# EAGLE design permamote (EAGLE 8.4.2)
AUTHOR: NEAL JACKSON; REV: A; TITLE: MOTE

## Sheet 1 of 4
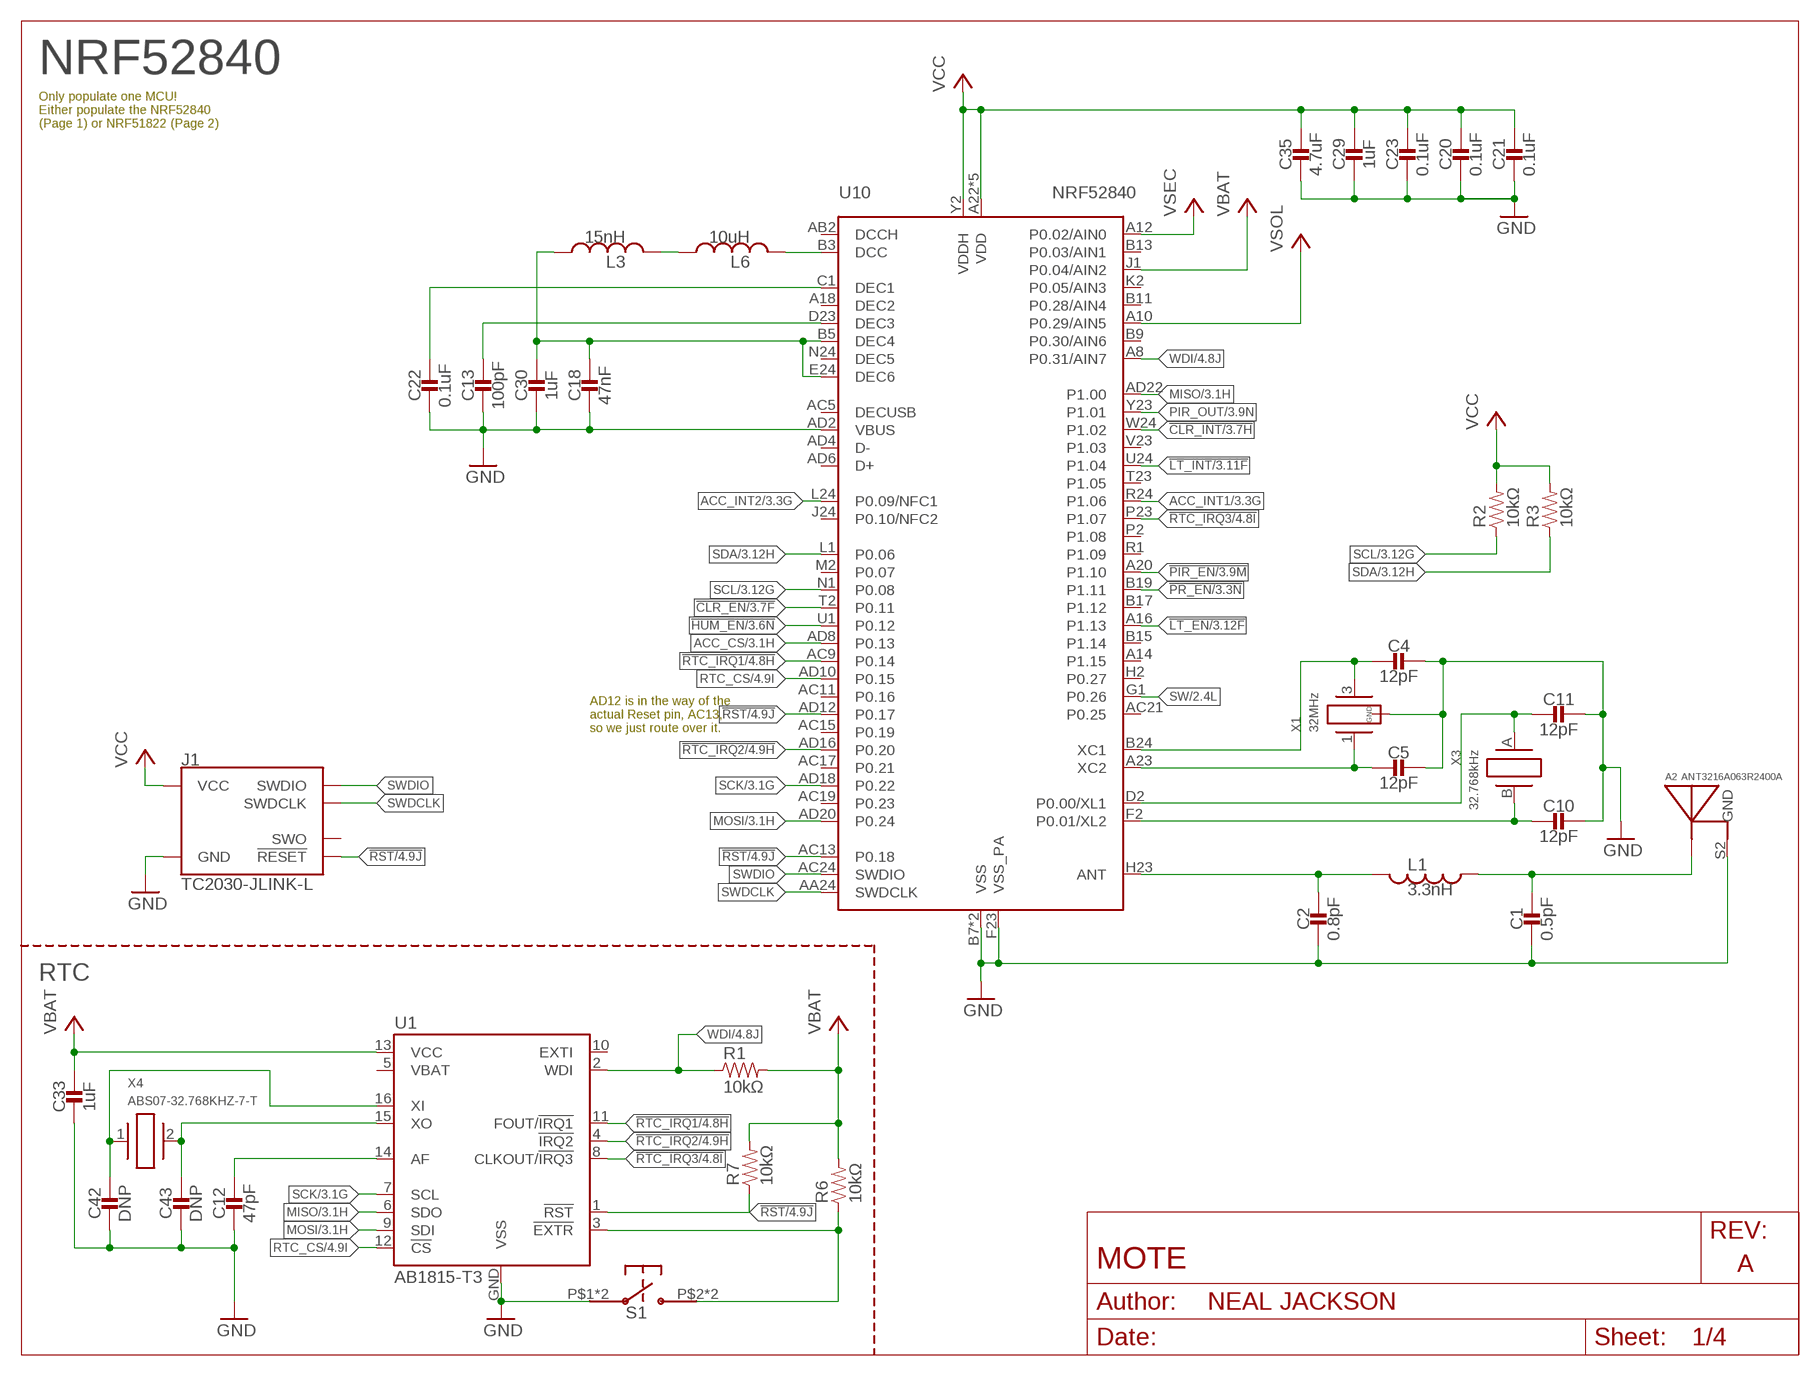
[diagram p0: schematic, sheet 1]

### Parts
A2  ANT3216A063R2400A  [ANT3216A063R2400A]
C1  0.5pF  CAPACITOR0402_CAP  [0402_CAP]
C2  0.8pF  CAPACITOR0402_CAP  [0402_CAP]
C4  12pF  CAPACITOR0402_CAP  [0402_CAP]
C5  12pF  CAPACITOR0402_CAP  [0402_CAP]
C10  12pF  CAPACITOR0402_CAP  [0402_CAP]
C11  12pF  CAPACITOR0402_CAP  [0402_CAP]
C12  47pF  CAPACITOR0402_CAP  [0402_CAP]
C13  100pF  CAPACITOR0402_CAP  [0402_CAP]
C18  47nF  CAPACITOR0402_CAP  [0402_CAP]
C20  0.1uF  CAPACITOR0402_CAP  [0402_CAP]
C21  0.1uF  CAPACITOR0402_CAP  [0402_CAP]
C22  0.1uF  CAPACITOR0402_CAP  [0402_CAP]
C23  0.1uF  CAPACITOR0402_CAP  [0402_CAP]
C29  1uF  CAPACITOR0402_CAP  [0402_CAP]
C30  1uF  CAPACITOR0402_CAP  [0402_CAP]
C33  1uF  CAPACITOR0402_CAP  [0402_CAP]
C35  4.7uF  CAPACITOR0402_CAP  [0402_CAP]
C42  DNP  CAPACITOR0402_CAP  [0402_CAP]
C43  DNP  CAPACITOR0402_CAP  [0402_CAP]
J1  TC2030-JLINK-L  [TC2030-IDC]
L1  3.3nH  INDUCTOR0402  [0402_CAP]
L3  15nH  INDUCTOR0402  [0402_CAP]
L6  10uH  INDUCTOR0603  [0603_CAP]
R1  10kΩ  RESISTOR0402_RES  [0402_RES]
R2  10kΩ  RESISTOR0402_RES  [0402_RES]
R3  10kΩ  RESISTOR0402_RES  [0402_RES]
R6  10kΩ  RESISTOR0402_RES  [0402_RES]
R7  10kΩ  RESISTOR0402_RES  [0402_RES]
S1  EVQP2  [EVQP2]
U1  AB1815-T3  [QFN-16-3MM]
U10  NRF52840  [AQFN73]
X1  32MHz  7V-32.000MAHV-T  [TXC-7V]
X3  32.768kHz  ABS05-32.768KHZ-9-T  [ABS05]
X4  ABS07-32.768KHZ-7-T  [2-SMD]

### Nets
!CLR_EN: U10.T2(P0.11) ; also sheet 3,4
!CLR_INT: U10.W24(P1.02) ; also sheet 3,4
!HUM_EN: U10.U1(P0.12) ; also sheet 3,4
!LT_EN: U10.A16(P1.13) ; also sheet 3,4
!LT_INT: U10.U24(P1.04) ; also sheet 3,4
!PIR_EN: U10.A20(P1.10) ; also sheet 3,4
!PR_EN: U10.B19(P1.11) ; also sheet 3,4
!RST: J1.3(!RESET) R7.1 U1.1(!RST) U10.AC13(P0.18) U10.AD12(P0.17) ; also sheet 4
!RTC_EXTR: R6.1 S1.P$2 S1.P$4 U1.3(!EXTR)
!RTC_IRQ1: U1.11(FOUT/!IRQ1) U10.AC9(P0.14) ; also sheet 4
!RTC_IRQ2: U1.4(!IRQ2) U10.AD16(P0.20) ; also sheet 4
!RTC_IRQ3: U1.8(CLKOUT/!IRQ3) U10.P23(P1.07) ; also sheet 4
ACC_CS: U10.AD8(P0.13) ; also sheet 3,4
ACC_INT1: U10.R24(P1.06) ; also sheet 3,4
ACC_INT2: U10.L24(P0.09/NFC1) ; also sheet 3,4
GND: A2.S2(GND) C1.2 C2.2 C4.1 C5.1 C10.1 C11.1 C12.2 C13.2 C18.2 C20.2 C21.2 C22.2 C23.2 C29.2 C30.2 C33.2 C35.2 C42.2 C43.2 J1.5(GND) S1.P$1 S1.P$3 U1.GND(VSS) U10.AD2(VBUS) U10.B7(VSS) U10.F23(VSS_PA) U10.GND(VSS) X1.2(GND) X1.4(GND) ; also sheet 2,3,4
MISO: U1.6(SDO) U10.AD22(P1.00) ; also sheet 3,4
MOSI: U1.9(SDI) U10.AD20(P0.24) ; also sheet 3,4
N$2: C22.1 U10.C1(DEC1)
N$3: C18.1 C30.1 L3.1 U10.B5(DEC4) U10.E24(DEC6)
N$4: C13.1 U10.D23(DEC3)
N$5: C2.1 L1.2 U10.H23(ANT)
N$6: A2.S1(ANTENNA) C1.1 L1.1
N$8: C4.2 U10.B24(XC1) X1.3
N$9: C5.2 U10.A23(XC2) X1.1
N$25: C12.1 U1.14(AF)
N$26: C42.1 U1.16(XI) X4.1
N$27: C43.1 U1.15(XO) X4.2
N$44: L6.2 U10.B3(DCC)
N$49: L3.2 L6.1
PIR_OUT: U10.Y23(P1.01) ; also sheet 3,4
RTC_CS: U1.12(!CS) U10.AD10(P0.15) ; also sheet 4
SCK: U1.7(SCL) U10.AD18(P0.22) ; also sheet 3,4
SCL: R2.1 U10.N1(P0.08) ; also sheet 3,4
SDA: R3.1 U10.L1(P0.06) ; also sheet 3,4
SW: U10.G1(P0.26) ; also sheet 2,4
SWDCLK: J1.4(SWDCLK) U10.AA24(SWDCLK)
SWDIO: J1.2(SWDIO) U10.AC24(SWDIO)
VBAT: C33.1 R1.2 R6.2 R7.2 U1.13(VCC) U10.J1(P0.04/AIN2) ; also sheet 2,4
VCC: C20.1 C21.1 C23.1 C29.1 C35.1 J1.1(VCC) R2.2 R3.2 U10.A22(VDD) U10.AD14(VDD) U10.AD23(VDD) U10.B1(VDD) U10.W1(VDD) U10.Y2(VDDH) ; also sheet 2,3,4
VSEC: U10.A12(P0.02/AIN0) ; also sheet 2,4
VSOL: U10.A10(P0.29/AIN5) ; also sheet 2,4
WDI: R1.1 U1.2(WDI) U10.A8(P0.31/AIN7) ; also sheet 4
XL1: C11.2 U10.D2(P0.00/XL1) X3.A
XL2: C10.2 U10.F2(P0.01/XL2) X3.B
Unconnected: J1.6(SWO) U1.5(VBAT) U1.10(EXTI) U10.A14(P1.15) U10.A18(DEC2) U10.AB2(DCCH) U10.AC5(DECUSB) U10.AC11(P0.16) U10.AC15(P0.19) U10.AC17(P0.21) U10.AC19(P0.23) U10.AC21(P0.25) U10.AD4(D-) U10.AD6(D+) U10.B9(P0.30/AIN6) U10.B11(P0.28/AIN4) U10.B13(P0.03/AIN1) U10.B15(P1.14) U10.B17(P1.12) U10.H2(P0.27) U10.J24(P0.10/NFC2) U10.K2(P0.05/AIN3) U10.M2(P0.07) U10.N24(DEC5) U10.P2(P1.08) U10.R1(P1.09) U10.T23(P1.05) U10.V23(P1.03)

### Notes on the sheet
- NRF52840
- Only populate one MCU!
  Either populate the NRF52840
  (Page 1) or NRF51822 (Page 2)
- AD12 is in the way of the
  actual Reset pin, AC13,
  so we just route over it.
- RTC

## Sheet 2 of 4
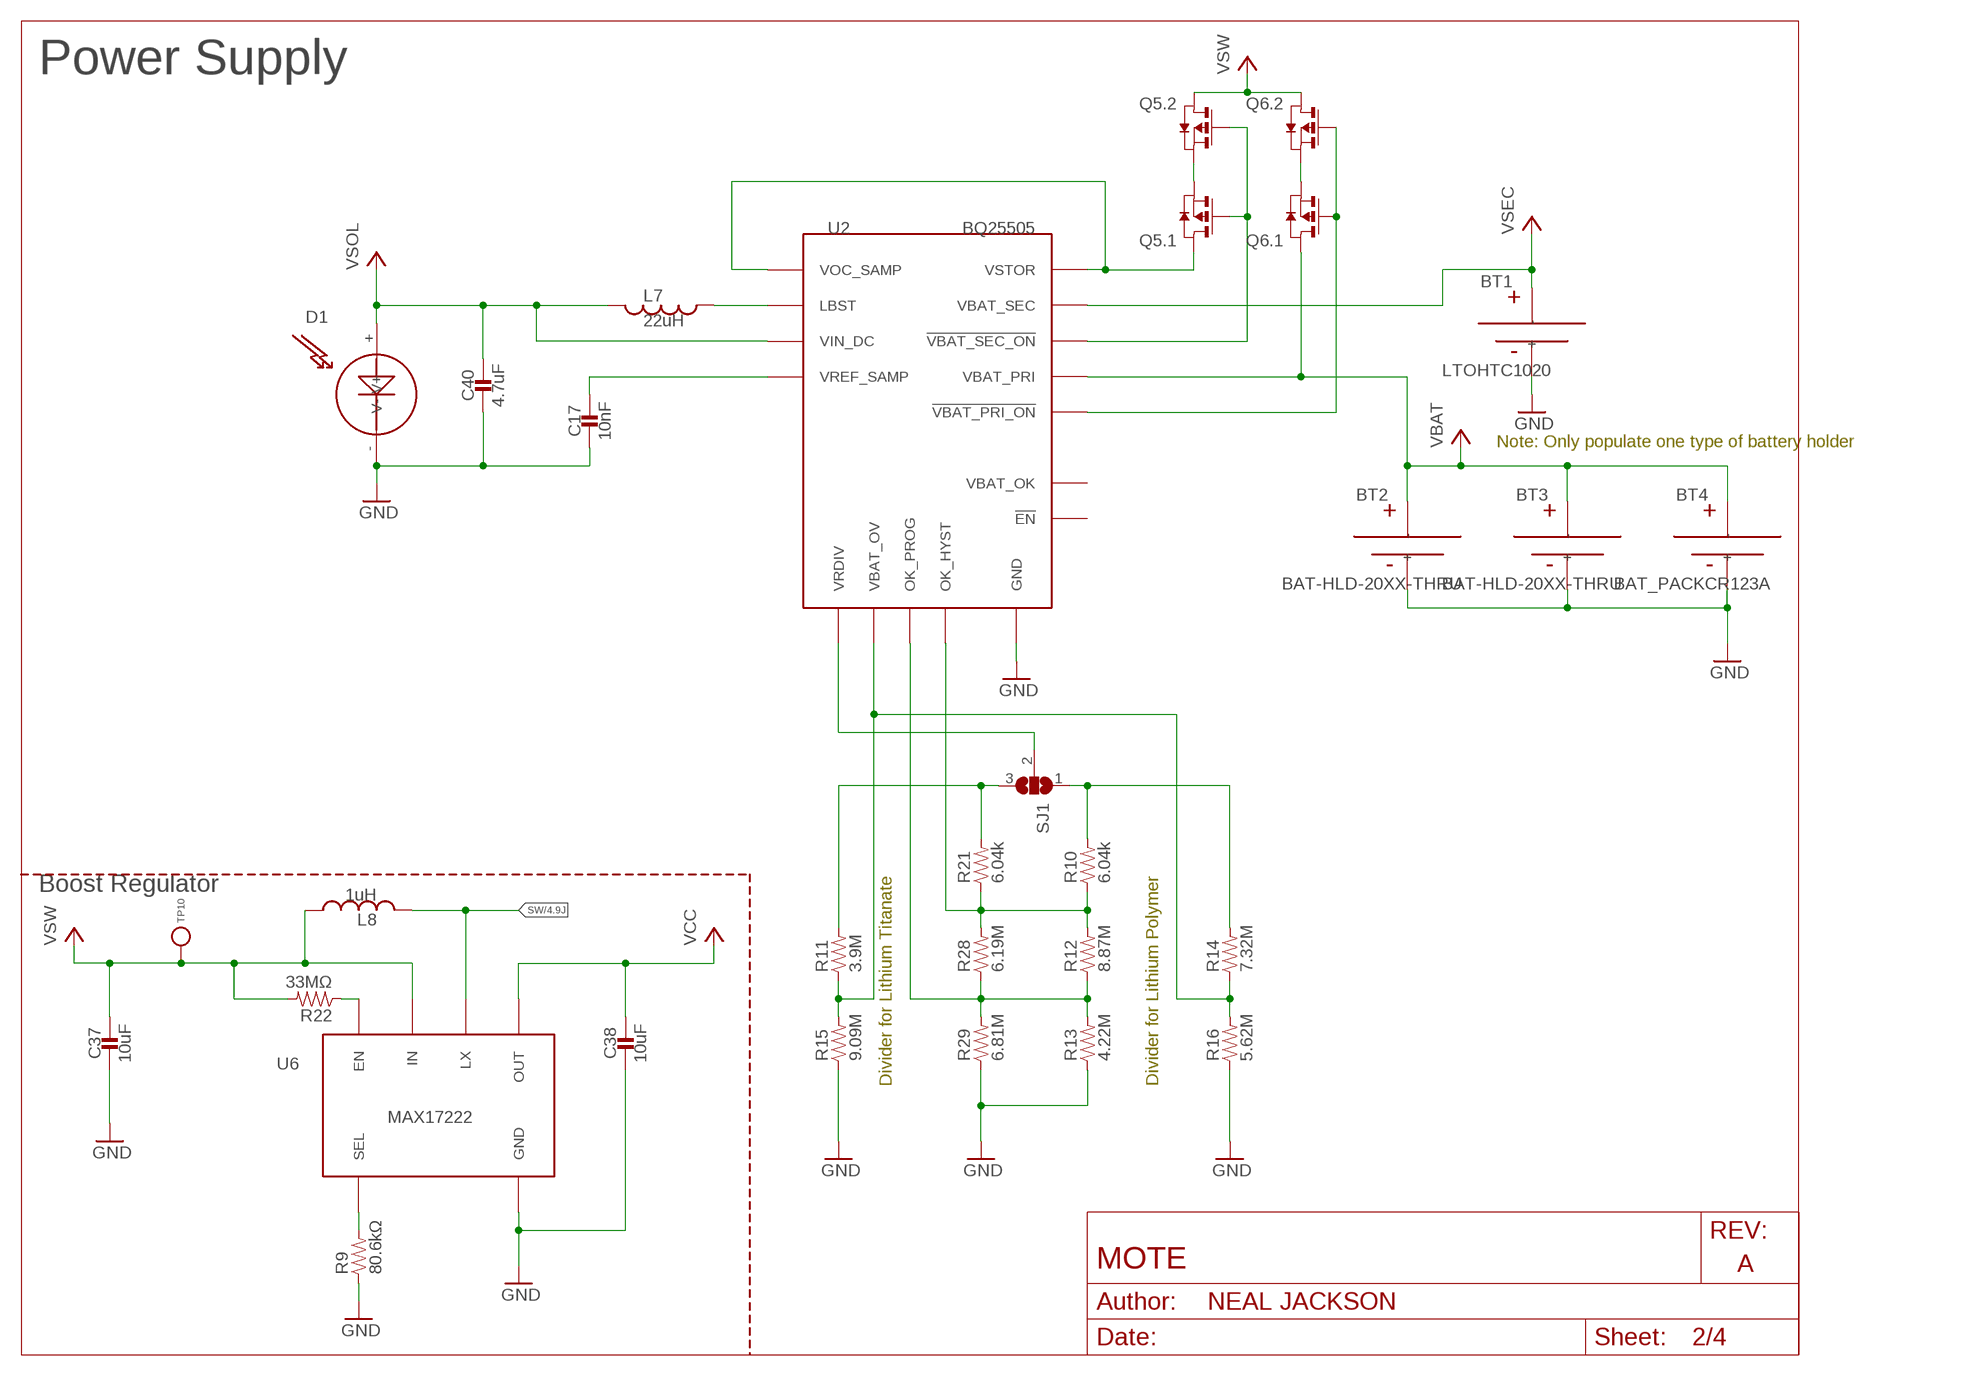
[diagram p1: schematic, sheet 2]

### Parts
BT1  LTOHTC1020  [1020]
BT2  BAT-HLD-20XX-THRU  [BAT-HLD-20XX-THRU]
BT3  BAT-HLD-20XX-THRU  [BAT-HLD-20XX-THRU]
BT4  BAT_PACKCR123A  [BH123A]
C17  10nF  CAPACITOR0603_CAP  [0603_CAP]
C37  10uF  CAPACITOR0603_CAP  [0603_CAP]
C38  10uF  CAPACITOR0603_CAP  [0603_CAP]
C40  4.7uF  CAPACITOR0603_CAP  [0603_CAP]
D1  SOLARCELL  [SOLAR_HOLES]
L7  22uH  INDUCTOR74437324220  [74437324220]
L8  1uH  INDUCTORIHL  [IHL-1212BZ-11]
Q5  PMDXB950UPEL  [XDFN-6]
Q6  PMDXB950UPEL  [XDFN-6]
R9  80.6kΩ  RESISTOR0603_RES  [0603-RES]
R10  6.04k  RESISTOR0402_RES  [0402_RES]
R11  3.9M  RESISTOR0402_RES  [0402_RES]
R12  8.87M  RESISTOR0402_RES  [0402_RES]
R13  4.22M  RESISTOR0402_RES  [0402_RES]
R14  7.32M  RESISTOR0402_RES  [0402_RES]
R15  9.09M  RESISTOR0402_RES  [0402_RES]
R16  5.62M  RESISTOR0402_RES  [0402_RES]
R21  6.04k  RESISTOR0402_RES  [0402_RES]
R22  33MΩ  RESISTOR0603_RES  [0603-RES]
R28  6.19M  RESISTOR0402_RES  [0402_RES]
R29  6.81M  RESISTOR0402_RES  [0402_RES]
SJ1  SJ2W  [SJ_2]
TP10  TEST_POINT_0.040IN  [TESTPOINT_0.040IN]
U2  BQ25505  [S-PVQFN-N20-RGR]
U6  MAX17222  [UDFN-6-MAXIM]

### Nets
GND: BT1.- BT2.GND(-) BT3.GND(-) BT4.- C17.2 C37.2 C38.2 C40.2 D1.-(V-) R9.1 R13.1 R15.1 R16.1 R29.1 U2.1(GND) U2.6(GND) U2.15(GND) U2.16(GND) U2.17(GND) U2.PAD(GND) U6.3(GND) ; also sheet 1,3,4
N$1: R11.2 R21.2 SJ1.3
N$12: R9.2 U6.4(SEL)
N$14: R22.1 U6.6(EN)
N$16: R10.2 R14.2 SJ1.1
N$18: R11.1 R14.1 R15.2 R16.2 U2.7(VBAT_OV)
N$30: C17.1 U2.4(VREF_SAMP)
N$32: SJ1.2 U2.8(VRDIV)
N$40: L7.P$1 U2.20(LBST)
N$45: Q5.1(.1:S) Q5.4(.2:S)
N$46: Q5.2(.1:G) Q5.5(.2:G) U2.9(!VBAT_SEC_ON)
N$47: Q5.6(.1:D) U2.3(VOC_SAMP) U2.19(VSTOR)
N$53: Q6.1(.1:S) Q6.4(.2:S)
N$56: Q6.2(.1:G) Q6.5(.2:G) U2.10(!VBAT_PRI_ON)
N$57: R12.1 R13.2 R28.1 R29.2 U2.12(OK_PROG)
N$58: R10.1 R12.2 R21.1 R28.2 U2.11(OK_HYST)
SW: L8.P$2 U6.2(LX) ; also sheet 1,4
VBAT: BT2.+1(+) BT2.+2(+) BT2.+3(+) BT2.+4(+) BT3.+1(+) BT3.+2(+) BT3.+3(+) BT3.+4(+) BT4.+ Q6.6(.1:D) U2.14(VBAT_PRI) ; also sheet 1,4
VCC: C38.1 U6.1(OUT) ; also sheet 1,3,4
VSEC: BT1.+ U2.18(VBAT_SEC) ; also sheet 1,4
VSOL: C40.1 D1.+(V+) L7.P$2 U2.2(VIN_DC) ; also sheet 1,4
VSW: C37.1 L8.P$1 Q5.3(.2:D) Q6.3(.2:D) R22.2 TP10.TESTPOINT U6.5(IN)
Unconnected: U2.5(!EN) U2.13(VBAT_OK)

### Notes on the sheet
- Power Supply
- Note: Only populate one type of battery holder
- Boost Regulator
- Divider for Lithium Titanate | Divider for Lithium Polymer

## Sheet 3 of 4
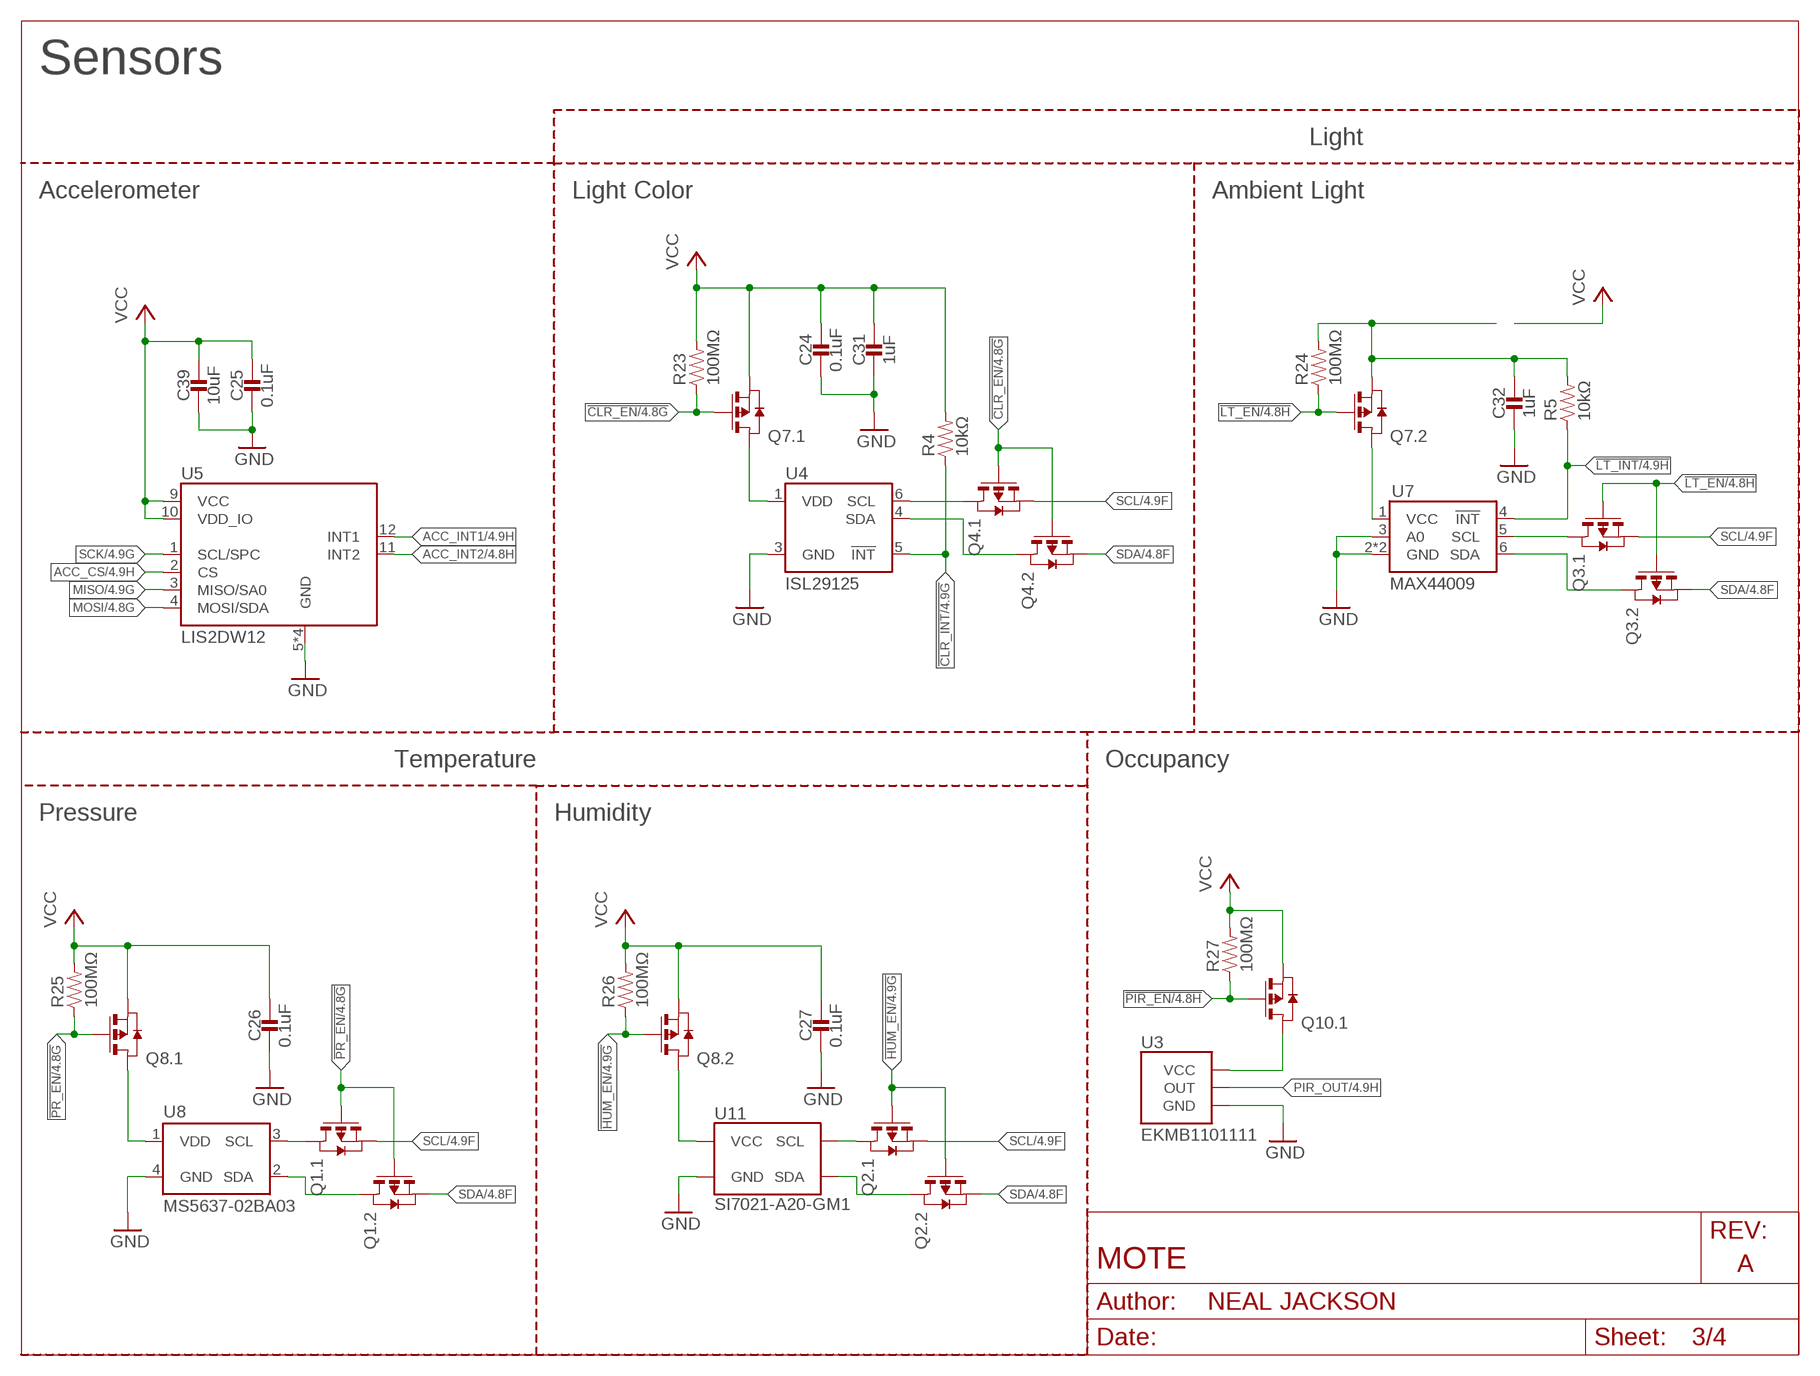
[diagram p2: schematic, sheet 3]

### Parts
C24  0.1uF  CAPACITOR0402_CAP  [0402_CAP]
C25  0.1uF  CAPACITOR0402_CAP  [0402_CAP]
C26  0.1uF  CAPACITOR0402_CAP  [0402_CAP]
C27  0.1uF  CAPACITOR0402_CAP  [0402_CAP]
C31  1uF  CAPACITOR0402_CAP  [0402_CAP]
C32  1uF  CAPACITOR0402_CAP  [0402_CAP]
C39  10uF  CAPACITOR0603_CAP  [0603_CAP]
Q1  PMDXB950UPEL  [XDFN-6]
Q2  PMDXB950UPEL  [XDFN-6]
Q3  PMDXB950UPEL  [XDFN-6]
Q4  PMDXB950UPEL  [XDFN-6]
Q7  PMDXB950UPEL  [XDFN-6]
Q8  PMDXB950UPEL  [XDFN-6]
Q10  PMDXB950UPEL  [XDFN-6]
R4  10kΩ  RESISTOR0402_RES  [0402_RES]
R5  10kΩ  RESISTOR0402_RES  [0402_RES]
R23  100MΩ  RESISTOR0402_RES  [0402_RES]
R24  100MΩ  RESISTOR0402_RES  [0402_RES]
R25  100MΩ  RESISTOR0402_RES  [0402_RES]
R26  100MΩ  RESISTOR0402_RES  [0402_RES]
R27  100MΩ  RESISTOR0402_RES  [0402_RES]
U3  EKMB1101111  [AMN2]
U4  ISL29125  [ODFN-6-1.5MMX1.6MM]
U5  LIS2DW12  [LGA-12]
U7  MAX44009  [UDFN-6-EXPOSED]
U8  MS5637-02BA03  [4-SMD]
U11  SI7021-A20-GM1  [DFN-6/3MM]

### Nets
!CLR_EN: Q4.2(.1:G) Q4.5(.2:G) Q7.2(.1:G) R23.1 ; also sheet 1,4
!CLR_INT: R4.1 U4.5(!INT) ; also sheet 1,4
!HUM_EN: Q2.2(.1:G) Q2.5(.2:G) Q8.5(.2:G) R26.1 ; also sheet 1,4
!LT_EN: Q3.2(.1:G) Q3.5(.2:G) Q7.5(.2:G) R24.1 ; also sheet 1,4
!LT_INT: R5.1 U7.4(!INT) ; also sheet 1,4
!PIR_EN: Q10.2(.1:G) R27.1 ; also sheet 1,4
!PR_EN: Q1.2(.1:G) Q1.5(.2:G) Q8.2(.1:G) R25.1 ; also sheet 1,4
ACC_CS: U5.2(CS) ; also sheet 1,4
ACC_INT1: U5.12(INT1) ; also sheet 1,4
ACC_INT2: U5.11(INT2) ; also sheet 1,4
GND: C24.2 C25.2 C26.2 C27.2 C31.2 C32.2 C39.2 U3.GND U4.3(GND) U5.5(GND) U5.6(GND) U5.7(GND) U5.8(GND) U7.2(GND) U7.3(A0) U7.EP(GND) U8.4(GND) U11.2(GND) ; also sheet 1,2,4
MISO: U5.3(MISO/SA0) ; also sheet 1,4
MOSI: U5.4(MOSI/SDA) ; also sheet 1,4
N$20: Q7.3(.2:D) U7.1(VCC)
N$21: Q8.6(.1:D) U8.1(VDD)
N$22: Q8.3(.2:D) U11.5(VCC)
N$23: Q10.6(.1:D) U3.VCC
N$31: Q7.6(.1:D) U4.1(VDD)
N$34: Q1.6(.1:D) U8.3(SCL)
N$37: C32.1 Q7.4(.2:S) R5.2 R24.2
N$41: Q1.3(.2:D) U8.2(SDA)
N$48: Q2.3(.2:D) U11.1(SDA)
N$50: Q2.6(.1:D) U11.6(SCL)
N$51: Q3.3(.2:D) U7.6(SDA)
N$52: Q3.6(.1:D) U7.5(SCL)
N$54: Q4.3(.2:D) U4.4(SDA)
N$55: Q4.6(.1:D) U4.6(SCL)
PIR_OUT: U3.OUT ; also sheet 1,4
SCK: U5.1(SCL/SPC) ; also sheet 1,4
SCL: Q1.1(.1:S) Q2.1(.1:S) Q3.1(.1:S) Q4.1(.1:S) ; also sheet 1,4
SDA: Q1.4(.2:S) Q2.4(.2:S) Q3.4(.2:S) Q4.4(.2:S) ; also sheet 1,4
VCC: C24.1 C25.1 C26.1 C27.1 C31.1 C39.1 Q7.1(.1:S) Q8.1(.1:S) Q8.4(.2:S) Q10.1(.1:S) R4.2 R23.2 R25.2 R26.2 R27.2 U5.9(VCC) U5.10(VDD_IO) ; also sheet 1,2,4
Unconnected: Q10.3(.2:D) Q10.4(.2:S) Q10.5(.2:G)

### Notes on the sheet
- Sensors
- Light
- Accelerometer | Light Color | Ambient Light
- Temperature | Occupancy
- Pressure | Humidity

## Sheet 4 of 4
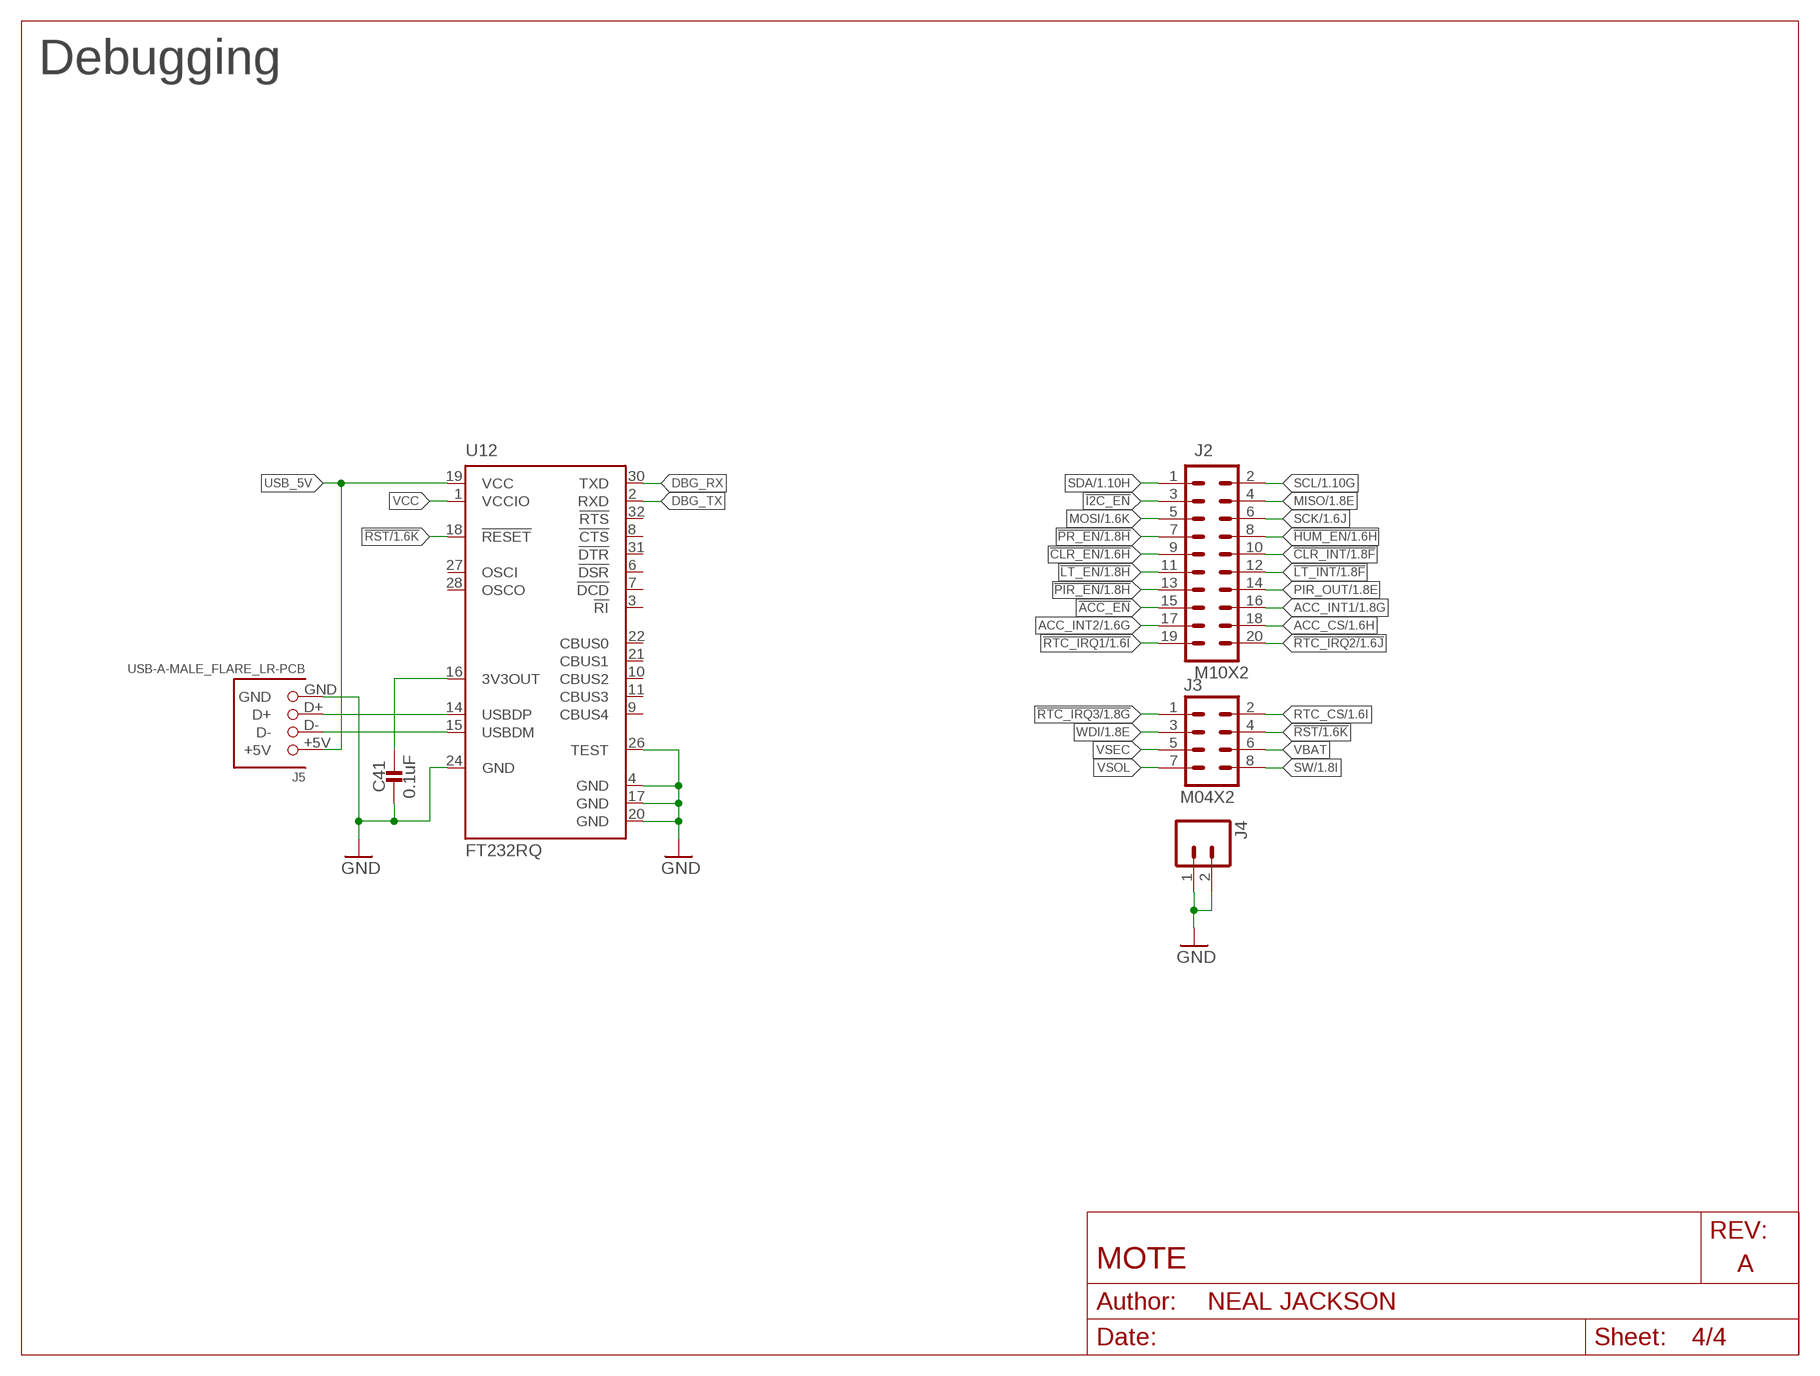
[diagram p3: schematic, sheet 4]

### Parts
C41  0.1uF  CAPACITOR0402_CAP  [0402_CAP]
J2  M10X2  [2X10]
J3  M04X2  [2X4]
J4  M02PTH  [1X02]
J5  USB-A-MALE_FLARE_LR-PCB  [USB-A-MALE_FLARE_LR]
U12  FT232RQ  [QFN32]

### Nets
!ACC_EN: J2.15
!CLR_EN: J2.9 ; also sheet 1,3
!CLR_INT: J2.10 ; also sheet 1,3
!HUM_EN: J2.8 ; also sheet 1,3
!I2C_EN: J2.3
!LT_EN: J2.11 ; also sheet 1,3
!LT_INT: J2.12 ; also sheet 1,3
!PIR_EN: J2.13 ; also sheet 1,3
!PR_EN: J2.7 ; also sheet 1,3
!RST: J3.4 U12.18(!RESET) ; also sheet 1
!RTC_IRQ1: J2.19 ; also sheet 1
!RTC_IRQ2: J2.20 ; also sheet 1
!RTC_IRQ3: J3.1 ; also sheet 1
ACC_CS: J2.18 ; also sheet 1,3
ACC_INT1: J2.16 ; also sheet 1,3
ACC_INT2: J2.17 ; also sheet 1,3
DBG_RX: U12.30(TXD)
DBG_TX: U12.2(RXD)
GND: C41.2 J4.1 J4.2 J5.GND U12.4(GND) U12.17(GND) U12.20(GND) U12.24(GND) U12.26(TEST) ; also sheet 1,2,3
MISO: J2.4 ; also sheet 1,3
MOSI: J2.5 ; also sheet 1,3
N$13: C41.1 U12.16(3V3OUT)
PIR_OUT: J2.14 ; also sheet 1,3
RTC_CS: J3.2 ; also sheet 1
SCK: J2.6 ; also sheet 1,3
SCL: J2.2 ; also sheet 1,3
SDA: J2.1 ; also sheet 1,3
SW: J3.8 ; also sheet 1,2
USB_5V: J5.+5V U12.19(VCC)
USB_D+: J5.D+ U12.14(USBDP)
USB_D-: J5.D- U12.15(USBDM)
VBAT: J3.6 ; also sheet 1,2
VCC: U12.1(VCCIO) ; also sheet 1,2,3
VSEC: J3.5 ; also sheet 1,2
VSOL: J3.7 ; also sheet 1,2
WDI: J3.3 ; also sheet 1
Unconnected: U12.3(!RI) U12.6(!DSR) U12.7(!DCD) U12.8(!CTS) U12.9(CBUS4) U12.10(CBUS2) U12.11(CBUS3) U12.21(CBUS1) U12.22(CBUS0) U12.27(OSCI) U12.28(OSCO) U12.31(!DTR) U12.32(!RTS)

### Notes on the sheet
- Debugging

## Library data of the parts
A2 = chips:ANT3216A063R2400A: Yageo 2.4GHz WiFi/Bluetooth/Zigbee/ISM Chip Antenna; DIGIKEY: 311-1542-1-ND; MANUFACTURER: YAGEO; MPN: ANT3216A063R2400A
BT1 = batteries:LTOHTC
BT2 BT3 = batteries:BAT-HLD-20XX-THRU: A through hole 2032 Battery Holder; DIGIKEY: BAT-HLD-001-THM-ND; MANUFACTURER: Linx Technologies; MPN: BAT-HLD-001-THM
BT4 = batteries:BAT_PACK: collection of battery footprints; DIGIKEY: BH123A-ND; MANUFACTURER: MPD; MPN: BH123A
C1 = passives:CAPACITOR: SMD Capacitor; DIGIKEY: 490-6264-1-ND
C2 = passives:CAPACITOR: SMD Capacitor; DIGIKEY: 490-6269-1-ND
C4 C5 C10 C11 = passives:CAPACITOR: SMD Capacitor; DIGIKEY: 490-6197-1-ND
C12 = passives:CAPACITOR: SMD Capacitor; DIGIKEY: 490-5942-1-ND
C13 = passives:CAPACITOR: SMD Capacitor; DIGIKEY: 490-5922-1-ND
C17 = passives:CAPACITOR: SMD Capacitor; DIGIKEY: 490-4516-1-ND
C18 = passives:CAPACITOR: SMD Capacitor; DIGIKEY: 445-1264-1-ND
C20-C27 C41 = passives:CAPACITOR: SMD Capacitor; DIGIKEY: 490-6328-1-ND
C29-C33 = passives:CAPACITOR: SMD Capacitor; DIGIKEY: 490-7195-1-ND
C35 = passives:CAPACITOR: SMD Capacitor; DIGIKEY: 445-5947-1-ND
C37-C40 = passives:CAPACITOR: SMD Capacitor; DIGIKEY: 490-3896-1-ND
C42 C43 = passives:CAPACITOR: SMD Capacitor
D1 = mote:SOLARCELL: Generic solar cell
J1 = connector:TC2030-JLINK
J2 = SparkFun-Connectors:M10X2: This was SPECIALLY designed to be used with our Graphic LCD Backpack. Be sure you want to use this! It is not only staggered on each line of header holes, but IT IS ALSO offset of the center point of the top and bottom lines by 5 mil. This causes the headers to lock into place on the "standard" footprint on the LCD screen. The extra squares on the tdocu layer are there simply to reference other pins (if you were to actually populate a longer header than ten long - this is what we do with the backpacks).
J3 = SparkFun-Connectors:M04X2: .1" header, two rows of four.
J4 = SparkFun-Connectors:M02: Header 2 Standard 2-pin 0.1" header. Use with straight break away headers (SKU : PRT-00116), right angle break away headers (PRT-00553), swiss pins (PRT-00743), machine pins (PRT-00117), and female headers (PRT-00115). Molex polarized connector foot print use with SKU : PRT-08233 with associated crimp pins and housings.
J5 = connector:USB-A-MALE_FLARE_LR-PCB: PCB USB Female A connector. Used to plug PCBs directly into USB sockets. This package flares out on both sides.
L1 = passives:INDUCTOR: A very specific inductor; DIGIKEY: 535-10426-1-ND
L3 = passives:INDUCTOR: A very specific inductor; DIGIKEY: 587-1521-1-ND
L6 = passives:INDUCTOR: A very specific inductor; DIGIKEY: 490-4025-1-ND
L7 = passives:INDUCTOR: A very specific inductor; DIGIKEY: 732-3340-1-ND
L8 = passives:INDUCTOR: A very specific inductor; DIGIKEY: 541-1319-1-ND; MANUFACTURER: Vishay Dale; MPN: IHLP1212BZER1R0M11
Q1-Q8 Q10 = fets:PMDXB950UPEL: 20 V 500mA, dual P-channel Trench MOSFET; DIGIKEY: 1727-2601-1-ND; MANUFACTURER: NEXPERIA; MPN: PMDXB950UPELZ
R1-R7 = passives:RESISTOR: Resistor Basic schematic elements and footprints for 0603, 1206, and PTH resistors.; DIGIKEY: 311-10KJRCT-ND
R9 = passives:RESISTOR: Resistor Basic schematic elements and footprints for 0603, 1206, and PTH resistors.; DIGIKEY: 311-80.6KHRCT-ND
R10-R16 R21 R28 R29 = passives:RESISTOR: Resistor Basic schematic elements and footprints for 0603, 1206, and PTH resistors.; DIGIKEY: YAG3306CT-ND
R22 = passives:RESISTOR: Resistor Basic schematic elements and footprints for 0603, 1206, and PTH resistors.; DIGIKEY: HMC0603JT33M0CT-ND
R23-R27 = passives:RESISTOR: Resistor Basic schematic elements and footprints for 0603, 1206, and PTH resistors.; DIGIKEY: 541-100MAHCT-ND
S1 = switches:EVQP2: SWITCH TACTILE SPST-NO 0.02A 15V; DIGIKEY: P11084SCT-ND
SJ1 = jumper:SJ2W: SMD solder JUMPER
TP10 = headers:TEST_POINT_0.040IN: 0.040in Test Point; DIGIKEY: 5001K-ND
U1 = chips:AB1815-T3: Ultra-low current RTC. 55nA quiescent @ 3V. 1.5-3.6V input.; DIGIKEY: 535-11936-1-ND; MANUFACTURER: Abracon; MPN: AB1815-T3
U2 = chips:BQ25505: EH front end for switching between primary and secondary cells; DIGIKEY: 296-37078-1-ND; MANUFACTURER: TI; MPN: BQ25505RGRR
U3 = chips:EKMB: Passive infrared human detection sensor with built-in amp.; DIGIKEY: 255-3065-ND; MANUFACTURER: PANASONIC; MPN: EKMB1101111
U4 = chips:ISL29125: low power i2c color sensor; DIGIKEY: ISL29125IROZ-T7ACT-ND; MANUFACTURER: INTERSIL; MPN: ISL29125IROZ-T7A
U5 = chips:LIS2DW12: ultra low power 3 axis accelerometer; MANUFACTURER: STMicroelectronics; MOUSER: 511-LIS2DW12TR; MPN: LIS2DW12TR
U6 = chips:MAX17222: Very high efficiency, very low power boost converter suitable for EH applications; DIGIKEY: MAX17222ELT+TCT-ND; MANUFACTURER: MAXIM INTEGRATED; MPN: MAX17222ELT+T
U7 = chips:MAX44009: low power ambient light sensor; DIGIKEY: MAX44009EDT+TCT-ND; MANUFACTURER: MAXIM; MPN: MAX44009EDT+T
U8 = chips:MS5637-02BA03: low power pressure sensor; DIGIKEY: 223-1199-1-ND; MANUFACTURER: TE CONNECTIVITY; MPN: MS563702BA03-50
U10 = chips:NRF52840: ultra-low power 2.4 GHz wireless system on chip (SoC) integrating a multiprotocol 2.4 GHz transceiver, an ARM® Cortex®-M4F CPU.; DIGIKEY: 1490-1071-1-ND; MANUFACTURER: NORIDIC SEMICONDUCTOR; MPN: NRF52840
U11 = chips:SI7021: IC TEMP SENSOR RH 2% DFN; DIGIKEY: 336-3141-ND; MOUSER: 634-SI7021-A20-GM1
U12 = ftdichip:FT232R: Source: http://www.ftdichip.com/Documents/DataSheets/DS_FT232R_v104.pdf; MPN: FT232RQ; OC_FARNELL: 1146033; OC_NEWARK: 91K9919
X1 = crystals:7V: TXC CRYSTAL SMD; DIGIKEY: 887-2568-1-ND; MANUFACTURER: TXC CORPORATION; MPN: 7M-32.000MAHV-T
X3 = crystals:ABS05-32.768KHZ: 32.768kHz Crystal; DIGIKEY: 535-11897-1-ND; MANUFACTURER: Abracon; MPN: ABS05-32.768KHZ-9-T
X4 = crystals:ABS07-32.768KHZ: 32.768kHz Crystal; DIGIKEY: 535-9543-1-ND; MANUFACTURER: ABRACON; MPN: ABS07-32.768KHZ-7-T

## Board
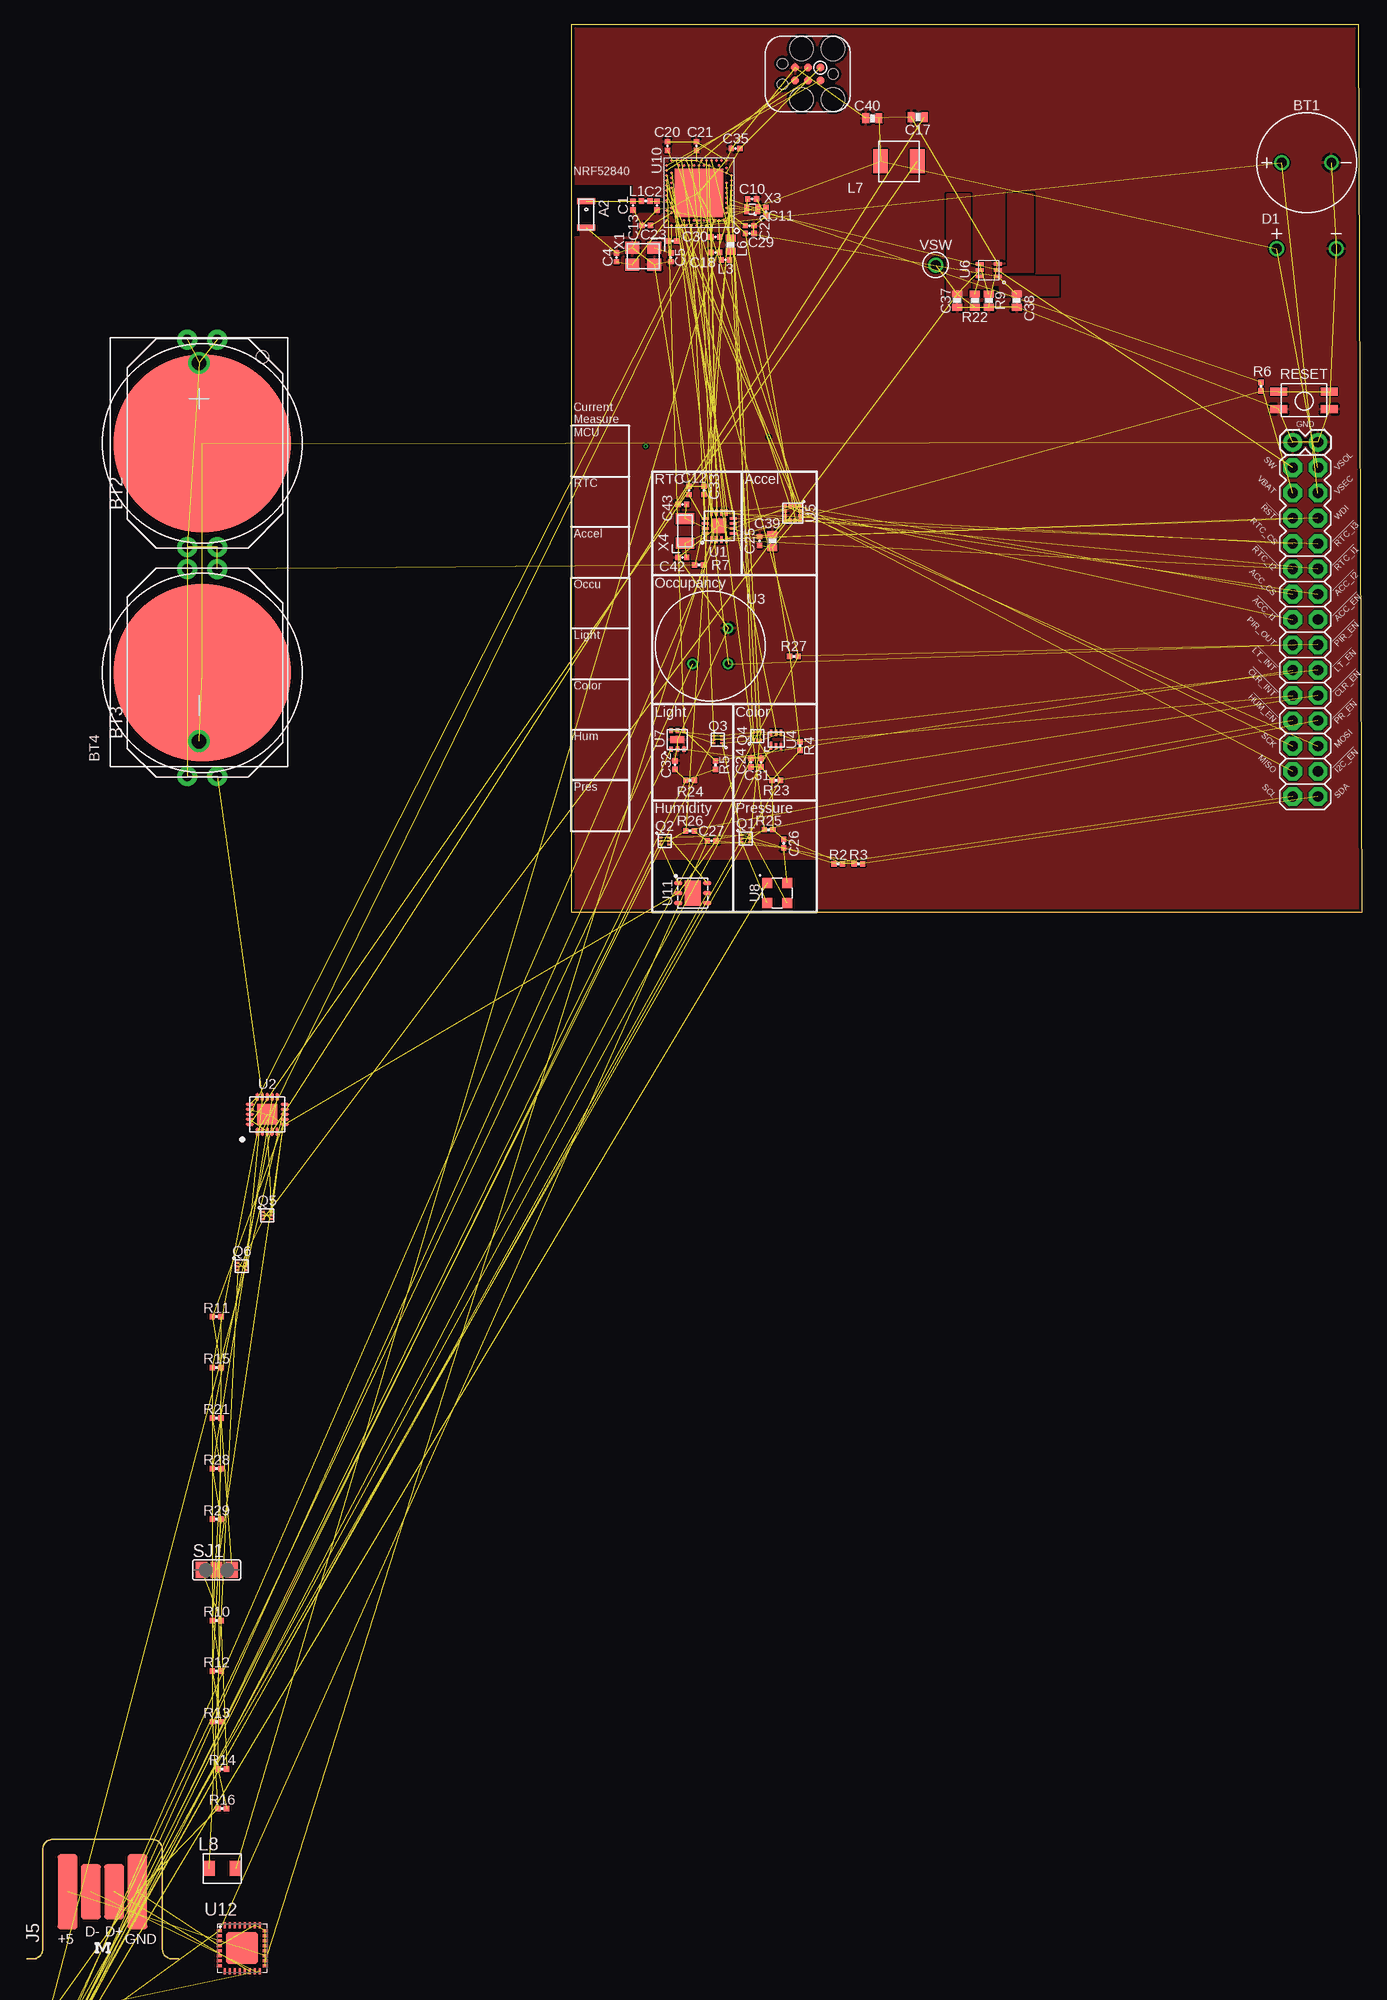
[diagram p4: board, top side]
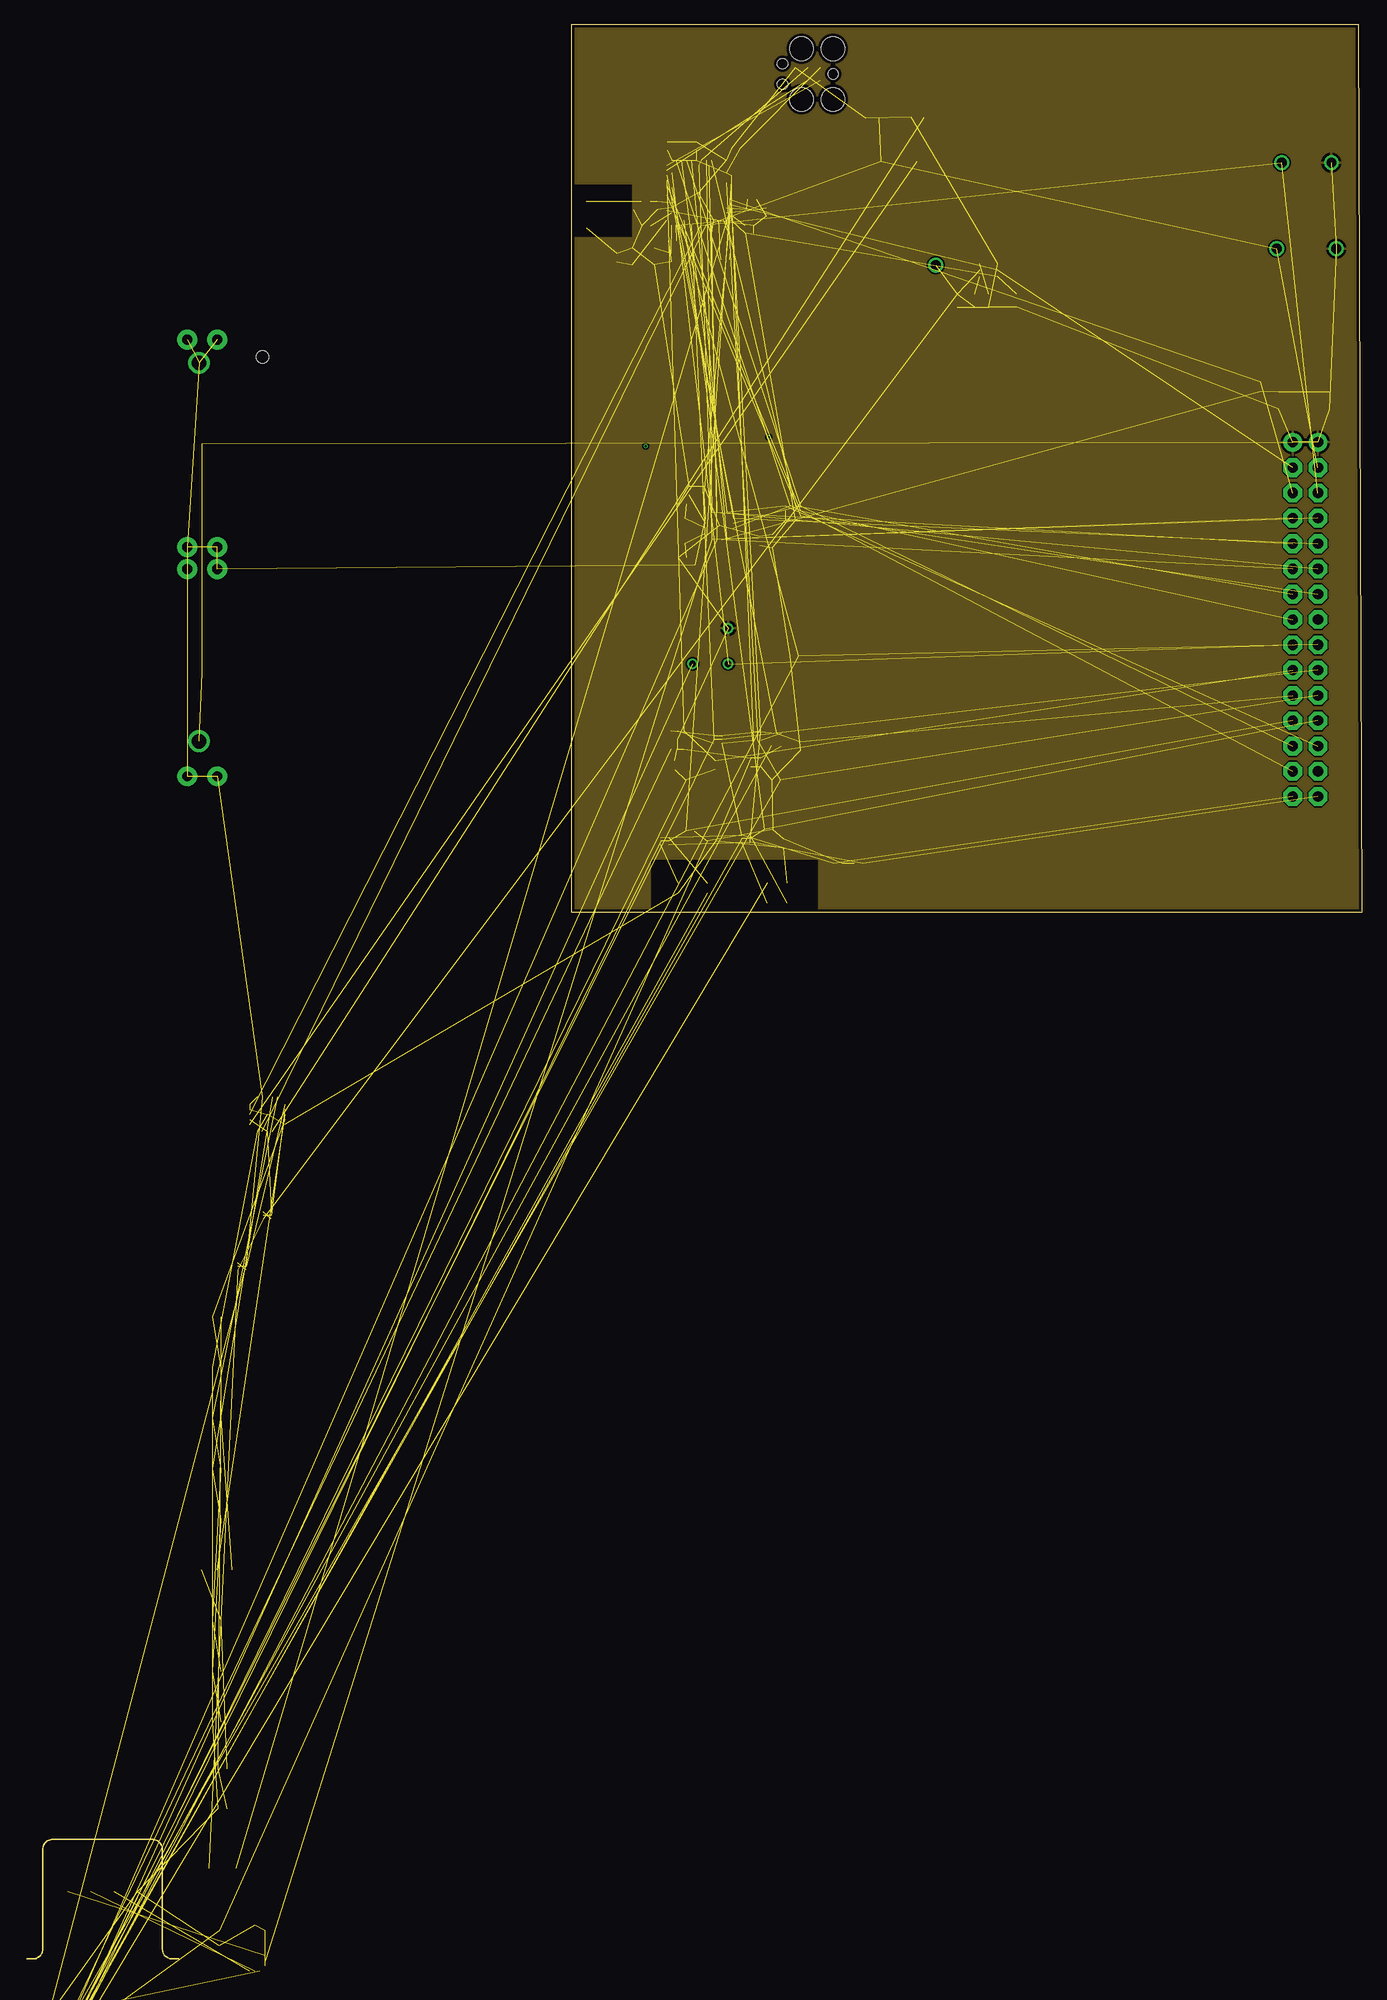
[diagram p5: board, inner layer Route2]
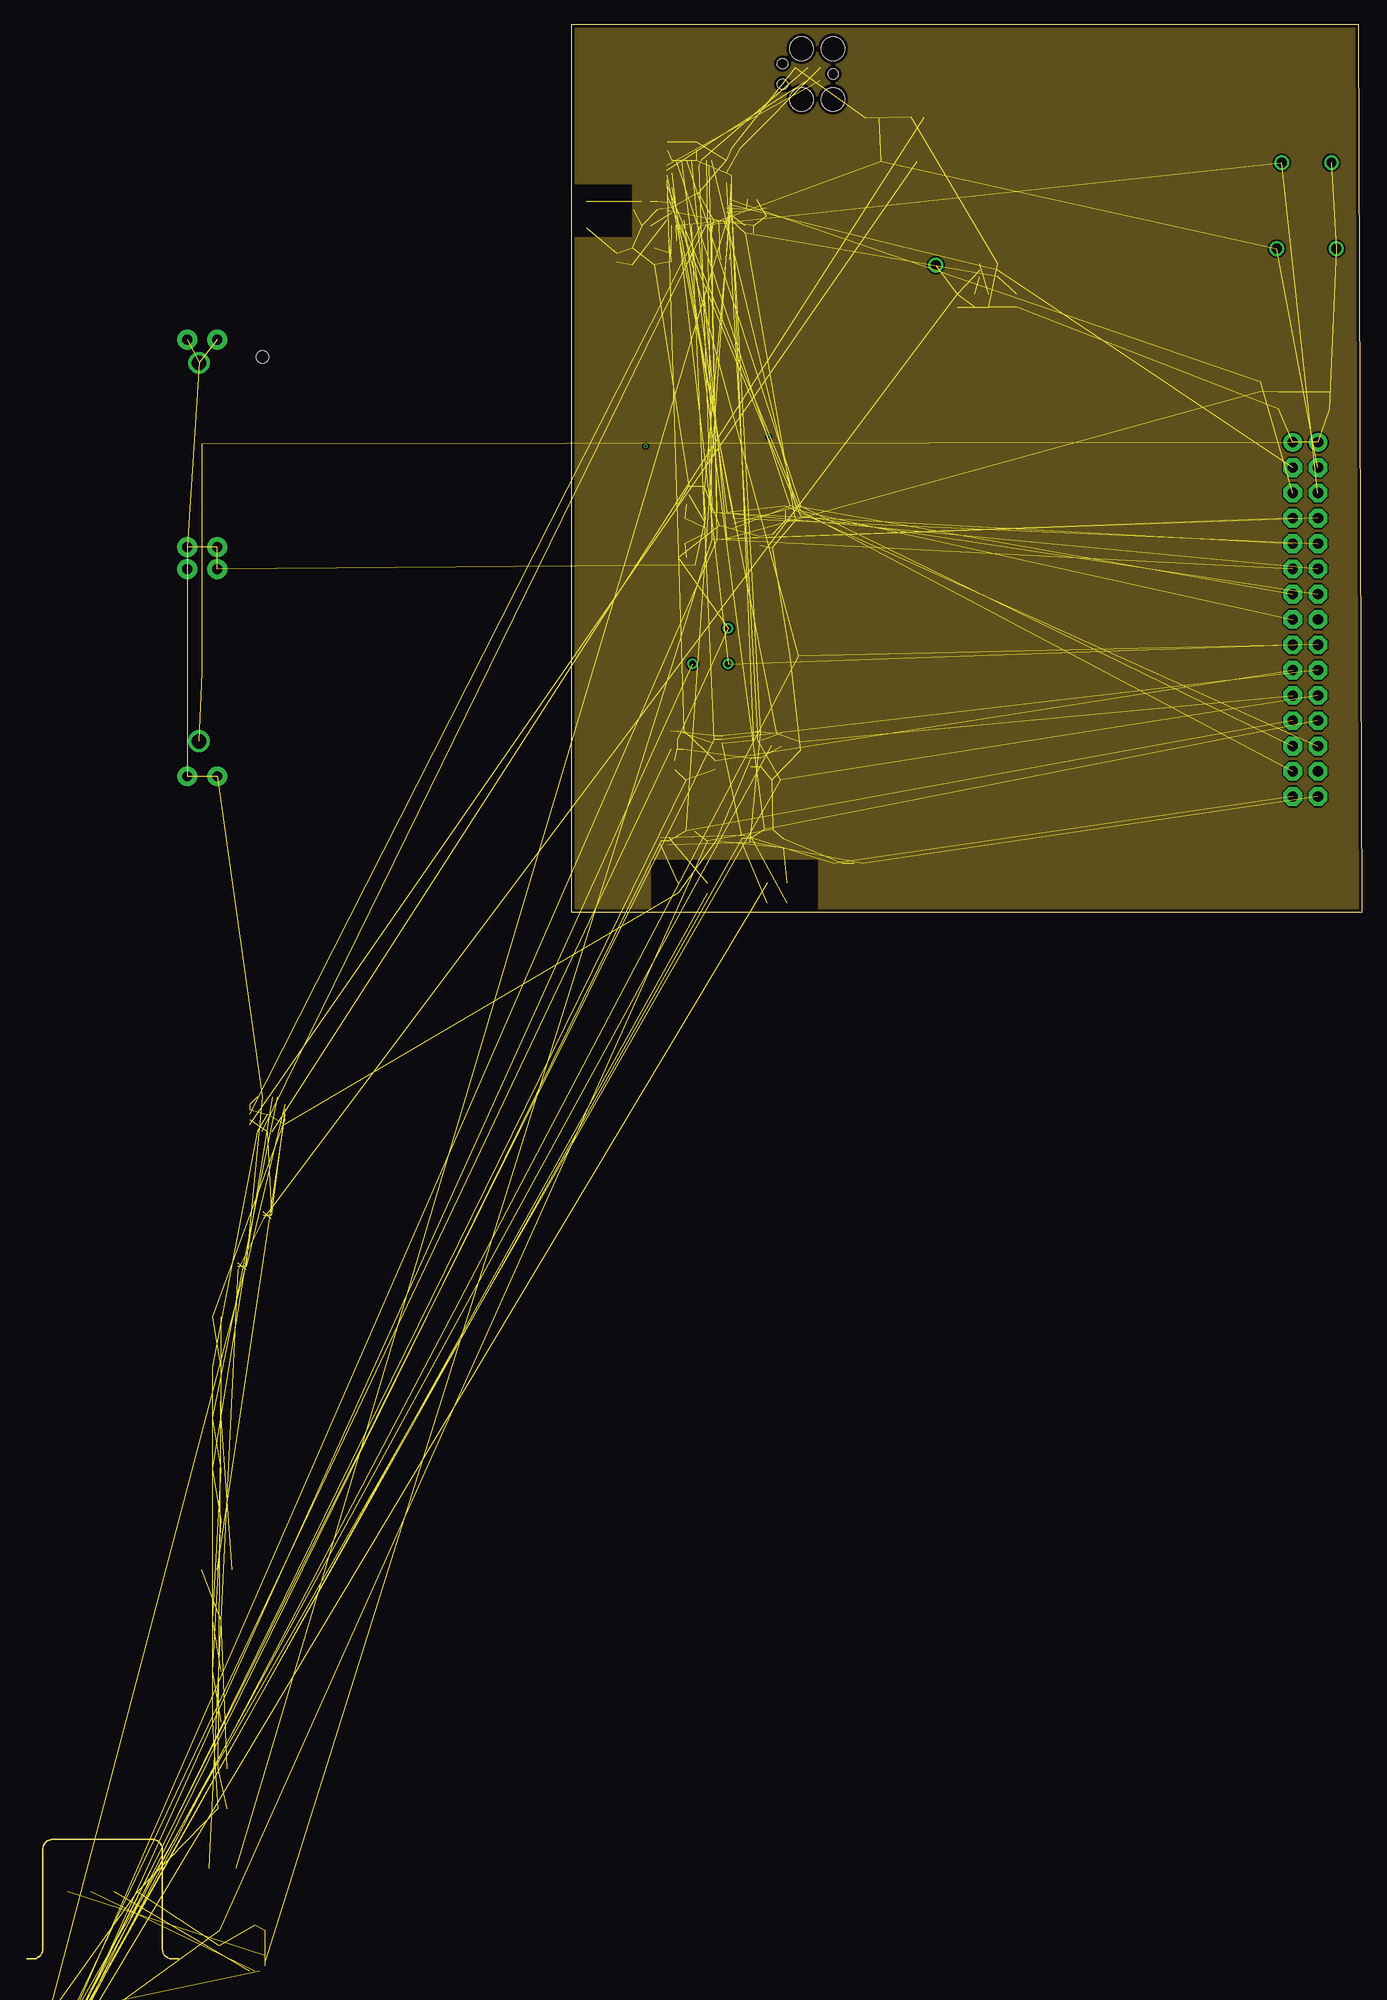
[diagram p6: board, inner layer Route15]
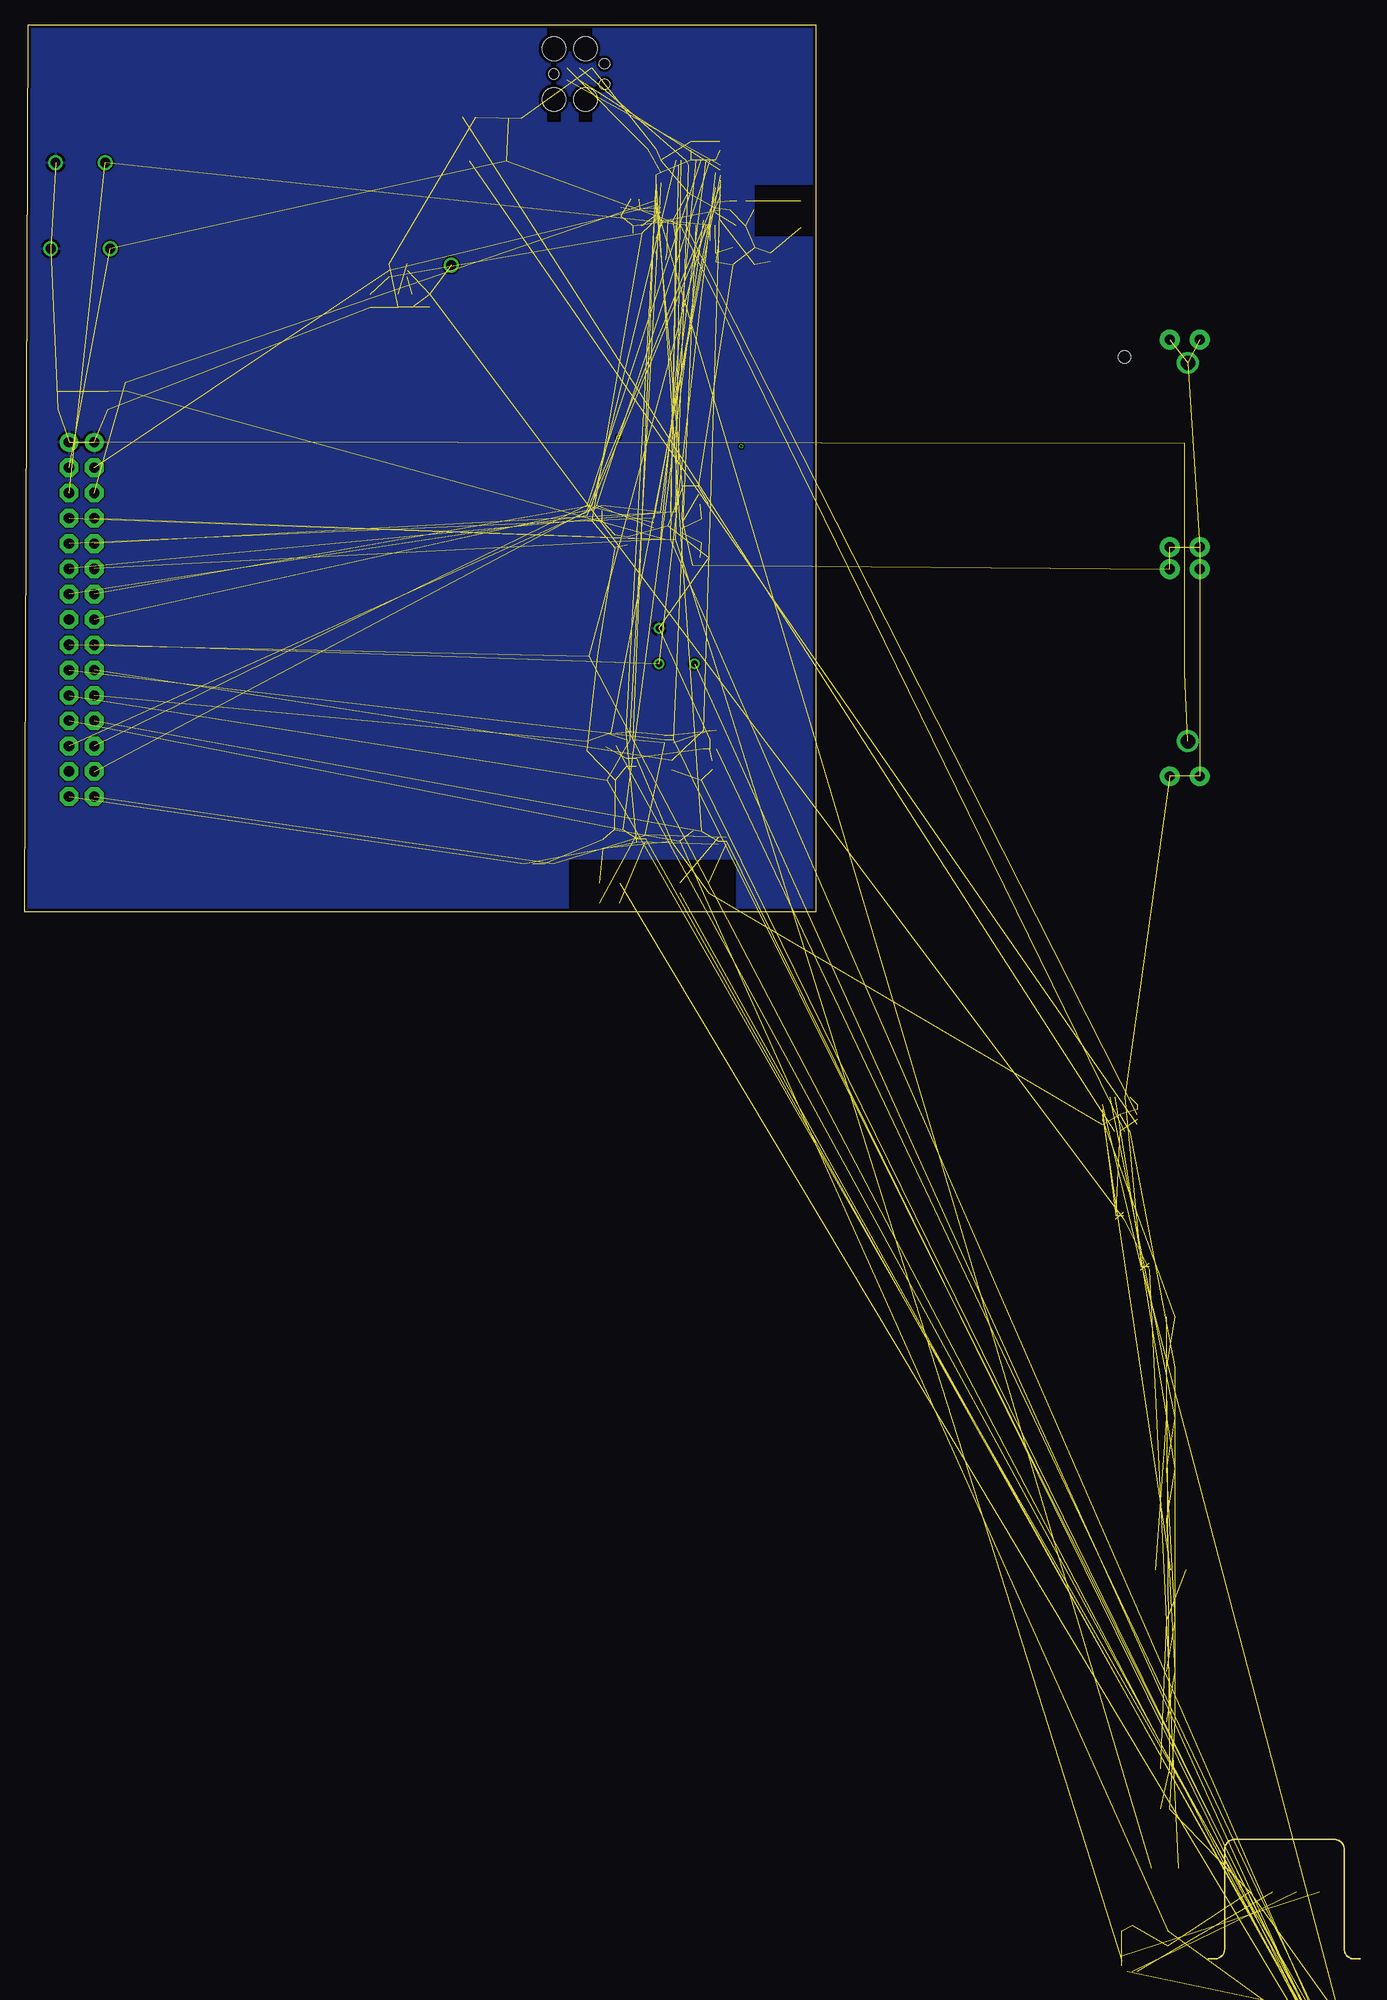
[diagram p7: board, bottom side, seen from below]

Size 133.97 x 194.08 mm. Coordinates in mm from the lower left corner, seen from the top.
Outline: 54.62,105.08 133.97,105.08 133.62,194.08 54.62,194.08 54.62,105.08
Copper layers (1+2*15+16): Top 0.0178mm / dielectric 59mil / Route2 0.0356mm / dielectric 0.1499mm / Route15 0.0356mm / dielectric 0.2007mm / Bottom 0.0178mm
Design rules "quickturn_co_kr_1oz_4lyr *": minimum track width 4mil, minimum drill 8mil, track to track 6mil, track to pad 6mil, pad to pad 6mil, via to via 6mil, smd to smd 6mil, copper to edge 12mil, drill to drill 12mil, minimum pad ring 8mil, minimum via ring 4mil, stop-mask expansion 3mil, vias tented up to drill 50mil, thermal gap 10mil

### Footprints (pad centres in the part's own frame; a part is rotated, then mirrored left to right if it is on the bottom)
ANT3216A063R2400A = smd 0.6 x 1.8: S1 -1.325,0; S2 1.325,0
1020 = drill 1: + -2.5,0; - 2.5,0
BAT-HLD-20XX-THRU = drill 1 pad 2: +1 -10.4,1.5; +2 -10.4,-1.5; +3 10.4,1.5; +4 10.4,-1.5 | smd 17.8 x 17.8: GND 0,0
BH123A = drill 1.47: + 18.985,0; - -18.985,0 | hole 1.27: 19.58,-6.37
0402_CAP = smd 0.536 x 0.546: 1 -0.433,0; 2 0.433,0
0603_CAP = smd 0.7 x 1: 1 -0.65,0; 2 0.65,0
SOLAR_HOLES = drill 1: + -3,0; - 3,0
TC2030-IDC = smd 0.787 x 0.787: 1 -1.27,-0.635; 2 -1.27,0.635; 3 0,-0.635; 4 0,0.635; 5 1.27,-0.635; 6 1.27,0.635 | hole 2.375: -2.54,2.54; 0.635,2.54; 0.635,-2.54; -2.54,-2.54 | hole 1.016: -2.54,0; 2.54,1.016; 2.54,-1.016
2X10 = drill 1.016 pad 1.88 octagon: 1 -11.43,-1.27; 2 -11.43,1.27; 3 -8.89,-1.27; 4 -8.89,1.27; 5 -6.35,-1.27; 6 -6.35,1.27; 7 -3.81,-1.27; 8 -3.81,1.27; 9 -1.27,-1.27; 10 -1.27,1.27; 11 1.27,-1.27; 12 1.27,1.27; 13 3.81,-1.27; 14 3.81,1.27; 15 6.35,-1.27; 16 6.35,1.27; 17 8.89,-1.27; 18 8.89,1.27; 19 11.43,-1.27; 20 11.43,1.27
2X4 = drill 1.016 pad 1.88 octagon: 1 -3.81,-1.27; 2 -3.81,1.27; 3 -1.27,-1.27; 4 -1.27,1.27; 5 1.27,-1.27; 6 1.27,1.27; 7 3.81,-1.27; 8 3.81,1.27
1X02 = drill 1.016 pad 1.88: 1 0,0; 2 2.54,0
USB-A-MALE_FLARE_LR = smd 2 x 7.5: +5V -3.5,1.67; GND 3.5,1.67 | smd 2 x 5.5: D+ 1.167,1.67; D- -1.167,1.67
74437324220 = smd 1.5 x 2.4: P$1 1.85,0; P$2 -1.85,0
IHL-1212BZ-11 = smd 1.2 x 1.5: P$1 -1.35,0; P$2 1.35,0
XDFN-6 = smd 0.35 x 0.2: 1 -0.425,0.35; 2 -0.425,0; 3 -0.425,-0.35; 4 0.425,-0.35; 5 0.425,0; 6 0.425,0.35
0402_RES = smd 0.536 x 0.546: 1 -0.433,0; 2 0.433,0
0603-RES = smd 0.7 x 1: 1 -0.65,0; 2 0.65,0
EVQP2 = smd 1.676 x 0.813: P$1 -2.54,-0.87; P$2 -2.54,0.908; P$3 2.54,-0.87; P$4 2.54,0.908
SJ_2 = smd 1.168 x 1.6: 1 -1.524,0; 2 0,0; 3 1.524,0
TESTPOINT_0.040IN = drill 1.016: TESTPOINT 0,0
QFN-16-3MM = smd 0.7 x 0.25: 1 -1.4,0.75; 2 -1.4,0.25; 3 -1.4,-0.25; 4 -1.4,-0.75; 9 1.35,-0.75; 10 1.35,-0.25; 11 1.35,0.25; 12 1.35,0.75 | smd 0.25 x 0.7: 5 -0.75,-1.4; 6 -0.25,-1.4; 7 0.25,-1.4; 8 0.75,-1.4; 13 0.75,1.4; 14 0.25,1.4; 15 -0.25,1.4; 16 -0.75,1.4 | smd 1.45 x 1.45: GND 0,0
S-PVQFN-N20-RGR = smd 0.28 x 0.85: 1 -1,-1.74; 2 -0.5,-1.74; 3 0,-1.74; 4 0.5,-1.74; 5 1,-1.74; 11 1,1.74; 12 0.5,1.74; 13 0,1.74; 14 -0.5,1.74; 15 -1,1.74 | smd 0.85 x 0.28: 6 1.74,-1; 7 1.74,-0.5; 8 1.74,0; 9 1.74,0.5; 10 1.74,1; 16 -1.74,1; 17 -1.74,0.5; 18 -1.74,0; 19 -1.74,-0.5; 20 -1.74,-1 | smd 2.05 x 2.05: PAD 0,0
AMN2 = drill 0.65: GND 1.796,-1.796; OUT -1.796,-1.796; VCC -1.796,1.796
ODFN-6-1.5MMX1.6MM = smd 0.8 x 0.25: 1 -0.6,0.5 | smd 0.65 x 0.25: 2 -0.675,0; 3 -0.675,-0.5; 4 0.675,-0.5; 5 0.675,0; 6 0.675,0.5
LGA-12 = smd 0.375 x 0.35: 1 -0.75,0.75; 2 -0.75,0.25; 3 -0.75,-0.25; 4 -0.75,-0.75; 7 0.75,-0.75; 8 0.75,-0.25; 9 0.75,0.25; 10 0.75,0.75 | smd 0.35 x 0.375: 5 -0.25,-0.75; 6 0.25,-0.75; 11 0.25,0.75; 12 -0.25,0.75
UDFN-6-MAXIM = smd 0.8 x 0.35: 1 -0.915,0.65; 2 -0.915,0; 3 -0.915,-0.65; 4 0.915,-0.65; 5 0.915,0; 6 0.915,0.65
UDFN-6-EXPOSED = smd 0.48 x 0.36: 1 -0.925,0.65; 2 -0.925,0; 3 -0.925,-0.65; 4 0.925,-0.65; 5 0.925,0; 6 0.925,0.65 | smd 0.71 x 1.4: EP 0,0
4-SMD = smd 1 x 1: 1 -1,1; 2 -1,-1; 3 1,-1; 4 1,1
AQFN73 = smd 0.3 x 0.3: A8 -1.25,3.25; A10 -0.75,3.25; A12 -0.25,3.25; A14 0.25,3.25; A16 0.75,3.25; A18 1.25,3.25; A20 1.75,3.25; A22 2.25,3.25; A23 2.75,3.25; AA24 3.25,-2.25; AB2 -2.75,-2.5; AC5 -2,-2.75; AC9 -1,-2.75; AC11 -0.5,-2.75; AC13 0,-2.75; AC15 0.5,-2.75; AC17 1,-2.75; AC19 1.5,-2.75; AC21 2,-2.75; AC24 3.25,-2.75; AD2 -2.75,-3.25; AD4 -2.25,-3.25; AD6 -1.75,-3.25; AD8 -1.25,-3.25; AD10 -0.75,-3.25; AD12 -0.25,-3.25; AD14 0.25,-3.25; AD16 0.75,-3.25; AD18 1.25,-3.25; AD20 1.75,-3.25; AD22 2.25,-3.25; AD23 2.75,-3.25; B1 -3.25,2.75; B3 -2.5,2.75; B5 -2,2.75; B7 -1.5,2.75; B9 -1,2.75; B11 -0.5,2.75; B13 0,2.75; B15 0.5,2.75; B17 1,2.75; B19 1.5,2.75; B24 3.25,2.75; C1 -3.25,2.25; D2 -2.75,2; D23 2.75,2; E24 3.25,1.75; F2 -2.75,1.5; F23 2.75,1.5; G1 -3.25,1.25; H2 -2.75,1; H23 2.75,1; J1 -3.25,0.75; J24 3.25,0.75; K2 -2.75,0.5; L1 -3.25,0.25; L24 3.25,0.25; M2 -2.75,0; N1 -3.25,-0.25; N24 3.25,-0.25; P2 -2.75,-0.5; P23 2.75,-0.5; R1 -3.25,-0.75; R24 3.25,-0.75; T2 -2.75,-1; T23 2.75,-1; U1 -3.25,-1.25; U24 3.25,-1.25; V23 2.75,-1.5; W1 -3.25,-1.75; W24 3.25,-1.75; Y2 -2.75,-2; Y23 2.75,-2 | smd 4.85 x 4.85: GND 0,0
DFN-6/3MM = smd 0.85 x 0.45: 1 -1.45,1; 2 -1.45,0; 3 -1.45,-1; 4 1.45,-1; 5 1.45,0; 6 1.45,1 | smd 1.6 x 2.5: P$1 0,0
QFN32 = smd 0.6 x 0.3: 1 -2.3,1.75; 2 -2.3,1.25; 3 -2.3,0.75; 4 -2.3,0.25; 5 -2.3,-0.25; 6 -2.3,-0.75; 7 -2.3,-1.25; 8 -2.3,-1.75; 17 2.3,-1.75; 18 2.3,-1.25; 19 2.3,-0.75; 20 2.3,-0.25; 21 2.3,0.25; 22 2.3,0.75; 23 2.3,1.25; 24 2.3,1.75 | smd 0.3 x 0.6: 9 -1.75,-2.3; 10 -1.25,-2.3; 11 -0.75,-2.3; 12 -0.25,-2.3; 13 0.25,-2.3; 14 0.75,-2.3; 15 1.25,-2.3; 16 1.75,-2.3; 25 1.75,2.3; 26 1.25,2.3; 27 0.75,2.3; 28 0.25,2.3; 29 -0.25,2.3; 30 -0.75,2.3; 31 -1.25,2.3; 32 -1.75,2.3 | smd 3.2 x 3.2: EXP 0,0
TXC-7V = smd 1.4 x 1.2: 1 -1.1,-0.85; 2 1.1,-0.85; 3 1.1,0.85; 4 -1.1,0.85
ABS05 = smd 0.5 x 1: A -0.55,0; B 0.55,0
2-SMD = smd 1.092 x 1.905: 1 -1.245,0; 2 1.245,0

### Placement (x,y rotation side)
A2  56.14,175.06 270 top
BT1  128.41,180.26 0 top
BT2  17.62,152.08 90 top
BT3  17.62,129.08 90 top
BT4  17.29,141.18 90 top
C1  60.84,175.96 270 top
C2  63.26,175.96 270 top
C4  59.19,170.75 270 top
C5  64.65,170.75 90 top
C10  72.78,176.6 180 top
C11  74.18,175.33 90 top
C12  66.43,147.37 90 top
C13  62.16,173.94 180 top
C17  89.42,184.84 180 top
C18  69.1,171.26 180 top
C20  64.27,181.93 90 top
C21  67.19,181.93 90 top
C22  72.53,173.93 0 top
C23  64.78,172.41 180 top
C24  72.65,120.07 90 top
C25  73.54,142.29 90 top
C26  75.96,111.94 270 top
C27  68.72,112.19 0 top
C29  72.53,173.17 0 top
C30  69.1,172.79 180 top
C31  73.67,120.07 90 top
C32  65.03,119.81 90 top
C33  67.95,147.37 90 top
C35  71.13,181.66 180 top
C37  93.35,166.42 270 top
C38  99.32,166.42 270 top
C39  74.81,142.29 90 top
C40  84.85,184.71 180 top
C41  1.62,-5.92 0 top  (outside the outline)
C42  65.8,140.64 180 top
C43  65.8,145.97 180 top
D1  128.41,171.63 0 top
J1  78.37,189.15 180 top
J2  128.28,128.07 90 top
J3  128.28,145.85 90 top
J4  127.01,152.2 0 top
J5  7.62,5.08 0 top
L1  62.11,176.39 0 top
L3  70.11,170.5 0 top
L6  70.62,172.02 90 top
L7  87.51,180.39 0 top
L8  19.62,9.08 0 top
Q1  72.15,112.45 0 top
Q2  64.02,112.19 0 top
Q3  69.35,122.35 180 top
Q4  73.29,122.73 90 top
Q5  24.14,74.6 0 top
Q6  21.6,69.52 0 top
Q7  2.62,-9.92 0 top  (outside the outline)
Q8  0.62,-14.92 0 top  (outside the outline)
Q10  -1.38,-19.92 0 top  (outside the outline)
R1  -3.38,-24.92 0 top  (outside the outline)
R2  81.42,109.91 0 top
R3  83.45,109.91 180 top
R4  77.61,121.72 270 top
R5  69.1,119.81 270 top
R6  123.84,157.78 90 top
R7  67.45,139.88 180 top
R9  96.53,166.42 90 top
R10  19.06,33.96 0 top
R11  19.06,64.44 0 top
R12  19.06,28.88 0 top
R13  19.06,23.8 0 top
R14  19.62,19.08 0 top
R15  19.06,59.36 0 top
R16  19.62,15.08 0 top
R21  19.06,54.28 0 top
R22  95.13,166.42 270 top
R23  75.19,118.29 180 top
R24  66.56,118.29 180 top
R25  74.43,113.33 0 top
R26  66.56,113.21 0 top
R27  76.97,130.73 180 top
R28  19.06,49.2 0 top
R29  19.06,44.12 0 top
S1  128.15,156.39 0 top
SJ1  19.06,39.04 0 top
TP10  91.2,169.98 180 top
U1  69.48,143.81 90 top
U2  24.14,84.76 0 top
U3  68.59,131.75 90 top
U4  75.19,122.35 90 top
U5  76.84,145.09 270 top
U6  96.53,169.47 180 top
U7  65.29,122.35 90 top
U8  75.32,106.98 0 top
U10  67.45,177.23 180 top
U11  66.81,106.98 0 top
U12  21.62,1.08 0 top
U$1  [UCB_CAL_200MIL]  53.13,220.03 0 top  (outside the outline)
X1  61.86,170.88 180 top
X3  72.78,175.58 180 top
X4  66.05,143.31 90 top

### Tracks (layer width: path | path; a pad name or v marks a point on that pad's centre or on a via)
!CLR_EN  (5 unrouted)
!CLR_INT  (3 unrouted)
!HUM_EN  (5 unrouted)
!LT_EN  (5 unrouted)
!LT_INT  (3 unrouted)
!PIR_EN  (3 unrouted)
!PR_EN  (5 unrouted)
!RST  (6 unrouted)
!RTC_EXTR  (3 unrouted)
!RTC_IRQ1  (2 unrouted)
!RTC_IRQ2  (2 unrouted)
!RTC_IRQ3  (2 unrouted)
ACC_CS  (2 unrouted)
ACC_INT1  (2 unrouted)
ACC_INT2  (2 unrouted)
GND  (77 unrouted)
  pour Top (rank 2): 54.62,194.08 133.62,194.08 133.87,105.08 54.62,105.08
  pour Bottom (rank 2): 54.62,194.08 133.62,194.08 133.87,105.08 54.62,105.08
  pour Top (rank 2, no thermals): 55.38,173.91 56.91,173.91 56.91,172.64 55.38,172.64
  pour Route2 (rank 2): 54.62,194.08 54.62,105.08 133.87,105.08 133.62,194.08
MISO  (3 unrouted)
MOSI  (3 unrouted)
N$1  (2 unrouted)
N$2  (1 unrouted)
N$3  (4 unrouted)
N$4  (1 unrouted)
N$5  (2 unrouted)
N$6  (2 unrouted)
N$7
  cutout Route2: 54.62,172.9 60.72,172.9 60.72,177.98 54.62,177.98
N$8  (2 unrouted)
N$9  (2 unrouted)
N$12  (1 unrouted)
N$13  (1 unrouted)
N$14  (1 unrouted)
N$16  (2 unrouted)
N$18  (4 unrouted)
N$20  (1 unrouted)
N$21  (1 unrouted)
N$22  (1 unrouted)
N$23  (1 unrouted)
N$25  (1 unrouted)
N$26  (2 unrouted)
N$27  (2 unrouted)
N$28  (via drill 0.2)
  other vias: 62.11,151.82
N$29  (via drill 0.2)
  other vias: 74.43,152.7
N$30  (1 unrouted)
N$31  (1 unrouted)
N$32  (1 unrouted)
N$34  (1 unrouted)
N$35
  cutout Route15: 54.62,172.9 60.72,172.9 60.72,177.98 54.62,177.98
N$37  (3 unrouted)
N$38
  cutout Top: 54.62,177.98 60.72,177.98 60.72,176.71 64.91,176.71 64.91,175.69 64.53,175.71 63.76,175.69 63.63,175.6 63.63,175.23 60.72,175.18 60.72,172.9 56.91,172.9 56.91,173.91 55.38,173.91 55.38,172.9 54.62,172.9
N$39
  cutout Bottom: 54.62,172.9 60.72,172.9 60.72,177.98 54.62,177.98
N$40  (1 unrouted)
N$41  (1 unrouted)
N$43
  cutout Top: 62.75,105.08 62.75,110.16 79.26,110.16 79.26,105.08
  cutout Bottom: 62.75,105.08 62.75,110.16 79.26,110.16 79.26,105.08
  cutout Route2: 62.75,105.08 62.75,110.16 79.26,110.16 79.26,105.08
  cutout Route15: 62.75,105.08 62.75,110.16 79.26,110.16 79.26,105.08
N$44  (1 unrouted)
N$45  (1 unrouted)
N$46  (2 unrouted)
N$47  (2 unrouted)
N$48  (1 unrouted)
N$49  (1 unrouted)
N$50  (1 unrouted)
N$51  (1 unrouted)
N$52  (1 unrouted)
N$53  (1 unrouted)
N$54  (1 unrouted)
N$55  (1 unrouted)
N$56  (2 unrouted)
N$57  (4 unrouted)
N$58  (4 unrouted)
PIR_OUT  (2 unrouted)
RTC_CS  (2 unrouted)
SCK  (3 unrouted)
SCL  (6 unrouted)
SDA  (6 unrouted)
SW  (3 unrouted)
  pour Top (isolate 0.203, no thermals): 97.16,169.32 100.97,169.32 100.97,177.09 98.44,177.09 98.44,169.72 97.16,169.72
SWDCLK  (1 unrouted)
SWDIO  (1 unrouted)
USB_5V  (1 unrouted)
USB_D+  (1 unrouted)
USB_D-  (1 unrouted)
VBAT  (17 unrouted)
VCC  (33 unrouted)
  pour Top (isolate 0.203, no thermals): 97.16,167.94 97.16,168.83 103.52,168.83 103.52,166.93 97.67,166.93 97.67,167.94
  pour Route15 (rank 2): 54.62,194.08 133.62,194.08 133.87,105.08 54.62,105.08
VSEC  (3 unrouted)
VSOL  (5 unrouted)
VSW  (6 unrouted)
  pour Top (isolate 0.203, no thermals): 95.89,169.22 94.62,169.22 94.62,166.93 92.34,166.93 92.34,177.09 94.62,177.09 94.62,169.72 95.89,169.72
WDI  (3 unrouted)
XL1  (2 unrouted)
XL2  (2 unrouted)

### Text on the board
tPlace: RTC | Accel | Occupancy | Light | Color | Humidity | Pressure
tNames: Permamote Eval / Neal Jackson / 10/17 | NRF52840 | VSW | RESET | Current / Measure | MCU | GND | SW | VSOL | RTC | VBAT | VSEC | !RST | WDI | Accel | RTC_CS | !RTC_I3 | !RTC_I2 | !RTC_I1 | Occu | ACC_CS | !ACC_I2 | !ACC_I1 | !ACC_EN | Light | PIR_OUT | !PIR_EN | !LT_INT | !LT_EN | Color | !CLR_INT | !CLR_EN | !HUM_EN | !PR_EN | Hum | SCK | MOSI | MISO | !I2C_EN | Pres | SCL | SDA